# Altium project k7-325t.PrjPcb
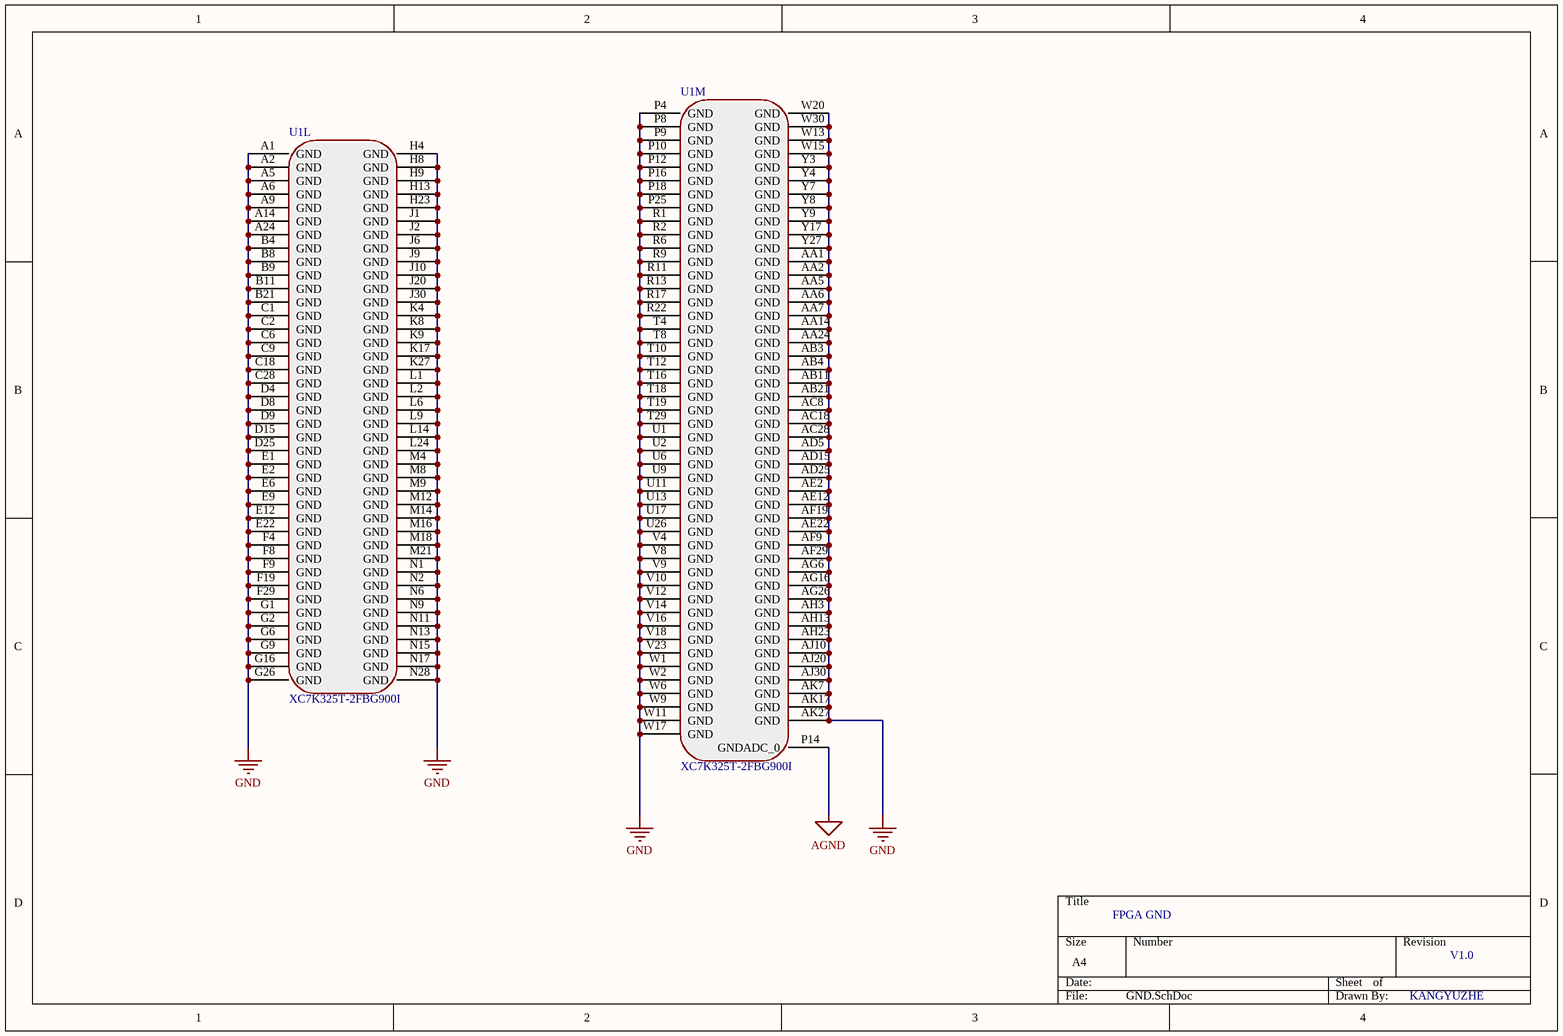
[diagram p0: GND.SchDoc]
15 sheets, 139 parts. Net scope: global (net labels, ports and power ports of the same name join across sheets).
Board files: PCB1.PcbDoc, XC7K325T.PcbDoc
Sheets:
  GND.SchDoc
  BANK0.SchDoc
  BANK12-13.SchDoc
  BANK14-15.SchDoc
  BANK16-17.SchDoc
  BANK18.SchDoc
  BANK32-33.SchDoc
  BANK34.SchDoc
  SD&UART&Sensor.SchDoc
  BANK115-116-117-118.SchDoc
  FPGA Power.SchDoc
  PAGE15 FLASH.SchDoc
  CLOCK.SchDoc
  INPUT.SchDoc
  IO.SchDoc

## Sheet GND.SchDoc
size A4

### Parts
U1  XC7K325T-2FBG900I  [FBG900]  (parts L,M of 17)

### Nets
AGND: U1.P14(GNDADC_0)
GND: U1.A1(GND) U1.A2(GND) U1.A5(GND) U1.A6(GND) U1.A9(GND) U1.A14(GND) U1.A24(GND) U1.AA1(GND) U1.AA2(GND) U1.AA5(GND) U1.AA6(GND) U1.AA7(GND) U1.AA14(GND) U1.AA24(GND) U1.AB3(GND) U1.AB4(GND) U1.AB11(GND) U1.AB21(GND) U1.AC8(GND) U1.AC18(GND) U1.AC28(GND) U1.AD5(GND) U1.AD15(GND) U1.AD25(GND) U1.AE2(GND) U1.AE12(GND) U1.AE22(GND) U1.AF9(GND) U1.AF19(GND) U1.AF29(GND) U1.AG6(GND) U1.AG16(GND) U1.AG26(GND) U1.AH3(GND) U1.AH13(GND) U1.AH23(GND) U1.AJ10(GND) U1.AJ20(GND) U1.AJ30(GND) U1.AK7(GND) U1.AK17(GND) U1.AK27(GND) U1.B4(GND) U1.B8(GND) U1.B9(GND) U1.B11(GND) U1.B21(GND) U1.C1(GND) U1.C2(GND) U1.C6(GND) U1.C9(GND) U1.C18(GND) U1.C28(GND) U1.D4(GND) U1.D8(GND) U1.D9(GND) U1.D15(GND) U1.D25(GND) U1.E1(GND) U1.E2(GND) U1.E6(GND) U1.E9(GND) U1.E12(GND) U1.E22(GND) U1.F4(GND) U1.F8(GND) U1.F9(GND) U1.F19(GND) U1.F29(GND) U1.G1(GND) U1.G2(GND) U1.G6(GND) U1.G9(GND) U1.G16(GND) U1.G26(GND) U1.H4(GND) U1.H8(GND) U1.H9(GND) U1.H13(GND) U1.H23(GND) U1.J1(GND) U1.J2(GND) U1.J6(GND) U1.J9(GND) U1.J10(GND) U1.J20(GND) U1.J30(GND) U1.K4(GND) U1.K8(GND) U1.K9(GND) U1.K17(GND) U1.K27(GND) U1.L1(GND) U1.L2(GND) U1.L6(GND) U1.L9(GND) U1.L14(GND) U1.L24(GND) U1.M4(GND) U1.M8(GND) U1.M9(GND) U1.M12(GND) U1.M14(GND) U1.M16(GND) U1.M18(GND) U1.M21(GND) U1.N1(GND) U1.N2(GND) U1.N6(GND) U1.N9(GND) U1.N11(GND) U1.N13(GND) U1.N15(GND) U1.N17(GND) U1.N28(GND) U1.P4(GND) U1.P8(GND) U1.P9(GND) U1.P10(GND) U1.P12(GND) U1.P16(GND) U1.P18(GND) U1.P25(GND) U1.R1(GND) U1.R2(GND) U1.R6(GND) U1.R9(GND) U1.R11(GND) U1.R13(GND) U1.R17(GND) U1.R22(GND) U1.T4(GND) U1.T8(GND) U1.T10(GND) U1.T12(GND) U1.T16(GND) U1.T18(GND) U1.T19(GND) U1.T29(GND) U1.U1(GND) U1.U2(GND) U1.U6(GND) U1.U9(GND) U1.U11(GND) U1.U13(GND) U1.U17(GND) U1.U26(GND) U1.V4(GND) U1.V8(GND) U1.V9(GND) U1.V10(GND) U1.V12(GND) U1.V14(GND) U1.V16(GND) U1.V18(GND) U1.V23(GND) U1.W1(GND) U1.W2(GND) U1.W6(GND) U1.W9(GND) U1.W11(GND) U1.W13(GND) U1.W15(GND) U1.W17(GND) U1.W20(GND) U1.W30(GND) U1.Y3(GND) U1.Y4(GND) U1.Y7(GND) U1.Y8(GND) U1.Y9(GND) U1.Y17(GND) U1.Y27(GND)

### Notes on the sheet
- FPGA GND
- V1.0
- KANGYUZHE

## Sheet BANK0.SchDoc
size A4
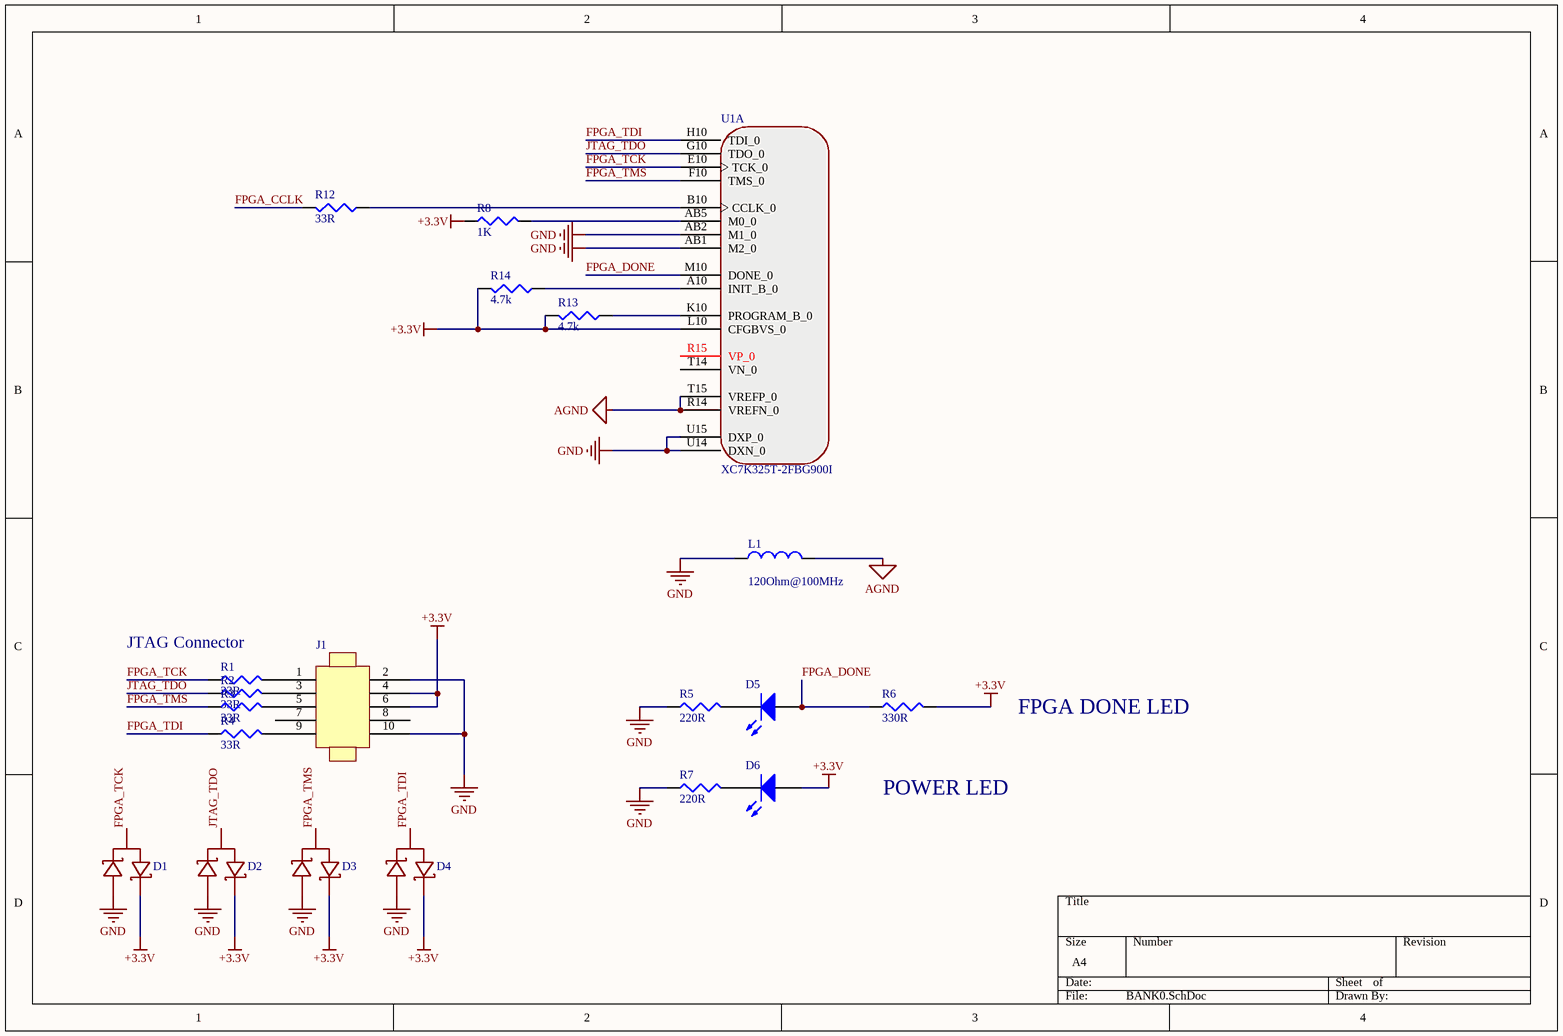
[diagram p1: BANK0.SchDoc]

### Parts
D1  BAT5S  [SOT-23]  (value not drawn)
D2  BAT5S  [SOT-23]  (value not drawn)
D3  BAT5S  [SOT-23]  (value not drawn)
D4  BAT5S  [SOT-23]  (value not drawn)
D5  LED3  [3.5X2.8X1.9]  (value not drawn)
D6  LED3  [3.5X2.8X1.9]  (value not drawn)
J1  JTAG-10  [JTAG-10]  (value not drawn)
L1  value 120Ohm@100MHz  [0402-A]  (hidden comment: Inductor)
R1  value 33R  [J1-0603]  (hidden comment: Res3)
R2  value 33R  [J1-0603]  (hidden comment: Res3)
R3  value 33R  [J1-0603]  (hidden comment: Res3)
R4  value 33R  [J1-0603]  (hidden comment: Res3)
R5  value 220R  [J1-0603]  (hidden comment: Res3)
R6  value 330R  [J1-0603]  (hidden comment: Res3)
R7  value 220R  [J1-0603]  (hidden comment: Res3)
R8  value 1K  [J1-0603]  (hidden comment: Res3)
R12  value 33R  [J1-0603]  (hidden comment: Res3)
R13  value 4.7k  [J1-0603]  (hidden comment: Res3)
R14  value 4.7k  [J1-0603]  (hidden comment: Res3)
U1  XC7K325T-2FBG900I  [FBG900]  (part A of 17)

### Nets
+3.3V: D1.2(K2) D2.2(K2) D3.2(K2) D4.2(K2) D6.1(A) J1.4 J1.6 R6.2 R8.1 R13.2 R14.2 U1.L10(CFGBVS_0)
AGND: L1.2 U1.R14(VREFN_0) U1.T15(VREFP_0)
GND: D1.1(A1) D2.1(A1) D3.1(A1) D4.1(A1) J1.2 J1.10 L1.1 R5.1 R7.1 U1.AB1(M2_0) U1.AB2(M1_0) U1.U14(DXN_0) U1.U15(DXP_0)
FPGA_CCLK: R12.2
FPGA_DONE: D5.1(A) R6.1 U1.M10(DONE_0)
FPGA_TCK: D1.3(A) R1.1 U1.E10(TCK_0)
FPGA_TDI: D4.3(A) R4.1 U1.H10(TDI_0)
FPGA_TMS: D3.3(A) R3.1 U1.F10(TMS_0)
JTAG_TDO: D2.3(A) R2.1 U1.G10(TDO_0)
NetD5_2: D5.2(K) R5.2
NetD6_2: D6.2(K) R7.2
NetJ1_1: J1.1 R1.2
NetJ1_3: J1.3 R2.2
NetJ1_5: J1.5 R3.2
NetJ1_9: J1.9 R4.2
NetR8_2: R8.2 U1.AB5(M0_0)
NetR12_1: R12.1 U1.B10(CCLK_0)
NetR13_1: R13.1 U1.K10(PROGRAM_B_0)
NetR14_1: R14.1 U1.A10(INIT_B_0)

Not connected (* = marked no-connect by the designer): J1 7 8; U1 R15(VP_0) T14(VN_0)

### Notes on the sheet
- JTAG Connector
- FPGA DONE LED
- POWER LED

### Library data of the parts
D5 D6 = LED3: Typical BLUE SiC LED; Published: 8-Jun-2000; LatestRevisionDate: 17-Dec-2003; LatestRevisionNote: PCB Footprint replaced.; DatasheetVersion: 16-Apr-2002; PackageVersion: 16-Apr-2002; PackageReference: 3.5X2.8X1.9; Publisher: Altium Limited; PackageDescription: SM LED; 2 C-Bend Leads; Body 3.5 x 2.8 x 1.9 mm, inc leads (LxWxH typ)
L1 = Inductor: Code_IEC: 1005; Published: 8-Jun-2000; LatestRevisionDate: 29-May-2009; LatestRevisionNote: IPC-7351 Footprint Added.; PackageReference: 0402-A; Publisher: Altium Limited; PackageDescription: Chip Inductor; Code_JEITA: 0402
R1-R8 R12-R14 = Res3: Resistor; Published: 8-Jun-2000; LatestRevisionDate: 29-May-2009; LatestRevisionNote: IPC-7351 Footprint Added.; PackageReference: J1-0603; Publisher: Altium Limited; PackageDescription: Chip Resistor

## Sheet BANK12-13.SchDoc
size A4
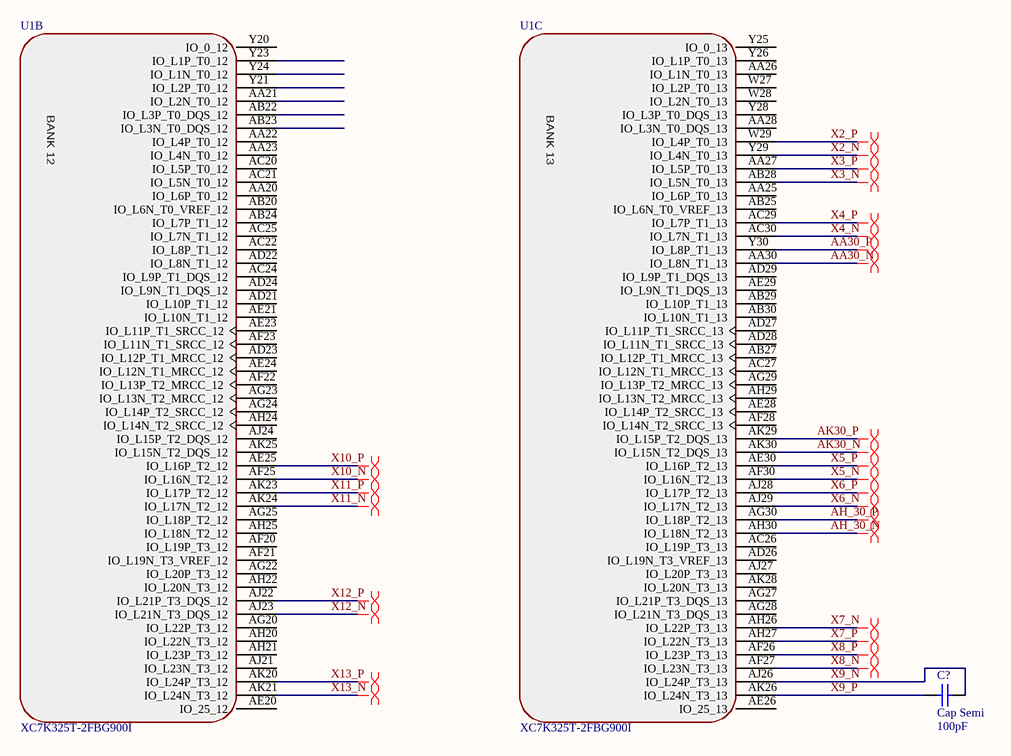
[diagram p2: BANK12-13.SchDoc]

### Parts
C?  Cap Semi  value 100pF  [C1206]
U1  XC7K325T-2FBG900I  [FBG900]  (parts B,C of 17)

### Nets
AA30_N: U1.AA30(IO_L8N_T1_13)
AA30_P: U1.Y30(IO_L8P_T1_13)
AH_30_N: U1.AH30(IO_L18N_T2_13)
AH_30_P: U1.AG30(IO_L18P_T2_13)
AK30_N: U1.AK30(IO_L15N_T2_DQS_13)
AK30_P: U1.AK29(IO_L15P_T2_DQS_13)
X2_N: U1.Y29(IO_L4N_T0_13)
X2_P: U1.W29(IO_L4P_T0_13)
X3_N: U1.AB28(IO_L5N_T0_13)
X3_P: U1.AA27(IO_L5P_T0_13)
X4_N: U1.AC30(IO_L7N_T1_13)
X4_P: U1.AC29(IO_L7P_T1_13)
X5_N: U1.AF30(IO_L16N_T2_13)
X5_P: U1.AE30(IO_L16P_T2_13)
X6_N: U1.AJ29(IO_L17N_T2_13)
X6_P: U1.AJ28(IO_L17P_T2_13)
X7_N: U1.AH26(IO_L22P_T3_13)
X7_P: U1.AH27(IO_L22N_T3_13)
X8_N: U1.AF27(IO_L23N_T3_13)
X8_P: U1.AF26(IO_L23P_T3_13)
X9_N: C?.2 U1.AJ26(IO_L24P_T3_13)
X9_P: C?.1 U1.AK26(IO_L24N_T3_13)
X10_N: U1.AF25(IO_L16N_T2_12)
X10_P: U1.AE25(IO_L16P_T2_12)
X11_N: U1.AK24(IO_L17N_T2_12)
X11_P: U1.AK23(IO_L17P_T2_12)
X12_N: U1.AJ23(IO_L21N_T3_DQS_12)
X12_P: U1.AJ22(IO_L21P_T3_DQS_12)
X13_N: U1.AK21(IO_L24N_T3_12)
X13_P: U1.AK20(IO_L24P_T3_12)

Not connected (* = marked no-connect by the designer): U1 AA20(IO_L6P_T0_12) AA21(IO_L2N_T0_12) AA22(IO_L4P_T0_12) AA23(IO_L4N_T0_12) AA25(IO_L6P_T0_13) AA26(IO_L1N_T0_13) AA28(IO_L3N_T0_DQS_13) AB20(IO_L6N_T0_VREF_12) AB22(IO_L3P_T0_DQS_12) AB23(IO_L3N_T0_DQS_12) AB24(IO_L7P_T1_12) AB25(IO_L6N_T0_VREF_13) AB27(IO_L12P_T1_MRCC_13) AB29(IO_L10P_T1_13) AB30(IO_L10N_T1_13) AC20(IO_L5P_T0_12) AC21(IO_L5N_T0_12) AC22(IO_L8P_T1_12) AC24(IO_L9P_T1_DQS_12) AC25(IO_L7N_T1_12) AC26(IO_L19P_T3_13) AC27(IO_L12N_T1_MRCC_13) AD21(IO_L10P_T1_12) AD22(IO_L8N_T1_12) AD23(IO_L12P_T1_MRCC_12) AD24(IO_L9N_T1_DQS_12) AD26(IO_L19N_T3_VREF_13) AD27(IO_L11P_T1_SRCC_13) AD28(IO_L11N_T1_SRCC_13) AD29(IO_L9P_T1_DQS_13) AE20(IO_25_12) AE21(IO_L10N_T1_12) AE23(IO_L11P_T1_SRCC_12) AE24(IO_L12N_T1_MRCC_12) AE26(IO_25_13) AE28(IO_L14P_T2_SRCC_13) AE29(IO_L9N_T1_DQS_13) AF20(IO_L19P_T3_12) AF21(IO_L19N_T3_VREF_12) AF22(IO_L13P_T2_MRCC_12) AF23(IO_L11N_T1_SRCC_12) AF28(IO_L14N_T2_SRCC_13) AG20(IO_L22P_T3_12) AG22(IO_L20P_T3_12) AG23(IO_L13N_T2_MRCC_12) AG24(IO_L14P_T2_SRCC_12) AG25(IO_L18P_T2_12) AG27(IO_L21P_T3_DQS_13) AG28(IO_L21N_T3_DQS_13) AG29(IO_L13P_T2_MRCC_13) AH20(IO_L22N_T3_12) AH21(IO_L23P_T3_12) AH22(IO_L20N_T3_12) AH24(IO_L14N_T2_SRCC_12) AH25(IO_L18N_T2_12) AH29(IO_L13N_T2_MRCC_13) AJ21(IO_L23N_T3_12) AJ24(IO_L15P_T2_DQS_12) AJ27(IO_L20P_T3_13) AK25(IO_L15N_T2_DQS_12) AK28(IO_L20N_T3_13) W27(IO_L2P_T0_13) W28(IO_L2N_T0_13) Y20(IO_0_12) Y21(IO_L2P_T0_12) Y23(IO_L1P_T0_12) Y24(IO_L1N_T0_12) Y25(IO_0_13) Y26(IO_L1P_T0_13) Y28(IO_L3P_T0_DQS_13)

### Layout directives
differential pair: AA30_N, AA30_P, AH_30_N, AH_30_P, AK30_N, AK30_P, X2_N, X2_P, X3_N, X3_P, X4_N, X4_P, X5_N, X5_P, X6_N, X6_P, X7_N, X7_P, X8_N, X8_P, X10_N, X10_P, X11_N, X11_P, X12_N, X12_P, X13_N, X13_P

### Notes on the sheet
- (in symbol XC7K325T-2FBG900I, part B) BANK 12
- (in symbol XC7K325T-2FBG900I, part C) BANK 13

### Library data of the parts
C? = Cap Semi: Capacitor (Semiconductor SIM Model); Published: 8-Jun-2000; LatestRevisionDate: 29-May-2009; LatestRevisionNote: IPC-7351 Footprint Added.; PackageReference: C1206; Publisher: Altium Limited; PackageDescription: Chip Capacitor

## Sheet BANK14-15.SchDoc
size A4
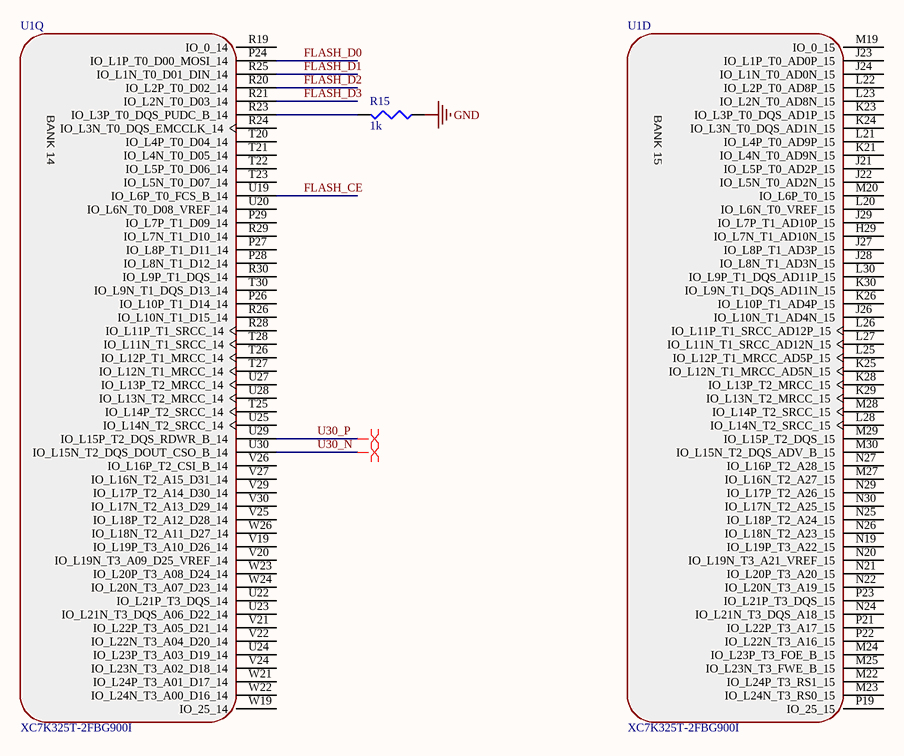
[diagram p3: BANK14-15.SchDoc]

### Parts
R15  value 1k  [J1-0603]  (hidden comment: Res3)
U1  XC7K325T-2FBG900I  [FBG900]  (parts D,Q of 17)

### Nets
GND: R15.1
FLASH_CE: U1.U19(IO_L6P_T0_FCS_B_14)
FLASH_D0: U1.P24(IO_L1P_T0_D00_MOSI_14)
FLASH_D1: U1.R25(IO_L1N_T0_D01_DIN_14)
FLASH_D2: U1.R20(IO_L2P_T0_D02_14)
FLASH_D3: U1.R21(IO_L2N_T0_D03_14)
U30_N: U1.U30(IO_L15N_T2_DQS_DOUT_CSO_B_14)
U30_P: U1.U29(IO_L15P_T2_DQS_RDWR_B_14)
NetR15_2: R15.2 U1.R23(IO_L3P_T0_DQS_PUDC_B_14)

Not connected (* = marked no-connect by the designer): U1 H29(IO_L7N_T1_AD10N_15) J21(IO_L5P_T0_AD2P_15) J22(IO_L5N_T0_AD2N_15) J23(IO_L1P_T0_AD0P_15) J24(IO_L1N_T0_AD0N_15) J26(IO_L10N_T1_AD4N_15) J27(IO_L8P_T1_AD3P_15) J28(IO_L8N_T1_AD3N_15) J29(IO_L7P_T1_AD10P_15) K21(IO_L4N_T0_AD9N_15) K23(IO_L3P_T0_DQS_AD1P_15) K24(IO_L3N_T0_DQS_AD1N_15) K25(IO_L12N_T1_MRCC_AD5N_15) K26(IO_L10P_T1_AD4P_15) K28(IO_L13P_T2_MRCC_15) K29(IO_L13N_T2_MRCC_15) K30(IO_L9N_T1_DQS_AD11N_15) L20(IO_L6N_T0_VREF_15) L21(IO_L4P_T0_AD9P_15) L22(IO_L2P_T0_AD8P_15) L23(IO_L2N_T0_AD8N_15) L25(IO_L12P_T1_MRCC_AD5P_15) L26(IO_L11P_T1_SRCC_AD12P_15) L27(IO_L11N_T1_SRCC_AD12N_15) L28(IO_L14N_T2_SRCC_15) L30(IO_L9P_T1_DQS_AD11P_15) M19(IO_0_15) M20(IO_L6P_T0_15) M22(IO_L24P_T3_RS1_15) M23(IO_L24N_T3_RS0_15) M24(IO_L23P_T3_FOE_B_15) M25(IO_L23N_T3_FWE_B_15) M27(IO_L16N_T2_A27_15) M28(IO_L14P_T2_SRCC_15) M29(IO_L15P_T2_DQS_15) M30(IO_L15N_T2_DQS_ADV_B_15) N19(IO_L19P_T3_A22_15) N20(IO_L19N_T3_A21_VREF_15) N21(IO_L20P_T3_A20_15) N22(IO_L20N_T3_A19_15) N24(IO_L21N_T3_DQS_A18_15) N25(IO_L18P_T2_A24_15) N26(IO_L18N_T2_A23_15) N27(IO_L16P_T2_A28_15) N29(IO_L17P_T2_A26_15) N30(IO_L17N_T2_A25_15) P19(IO_25_15) P21(IO_L22P_T3_A17_15) P22(IO_L22N_T3_A16_15) P23(IO_L21P_T3_DQS_15) P26(IO_L10P_T1_D14_14) P27(IO_L8P_T1_D11_14) P28(IO_L8N_T1_D12_14) P29(IO_L7P_T1_D09_14) R19(IO_0_14) R24(IO_L3N_T0_DQS_EMCCLK_14) R26(IO_L10N_T1_D15_14) R28(IO_L11P_T1_SRCC_14) R29(IO_L7N_T1_D10_14) R30(IO_L9P_T1_DQS_14) T20(IO_L4P_T0_D04_14) T21(IO_L4N_T0_D05_14) T22(IO_L5P_T0_D06_14) T23(IO_L5N_T0_D07_14) T25(IO_L14P_T2_SRCC_14) T26(IO_L12P_T1_MRCC_14) T27(IO_L12N_T1_MRCC_14) T28(IO_L11N_T1_SRCC_14) T30(IO_L9N_T1_DQS_D13_14) U20(IO_L6N_T0_D08_VREF_14) U22(IO_L21P_T3_DQS_14) U23(IO_L21N_T3_DQS_A06_D22_14) U24(IO_L23P_T3_A03_D19_14) U25(IO_L14N_T2_SRCC_14) U27(IO_L13P_T2_MRCC_14) U28(IO_L13N_T2_MRCC_14) V19(IO_L19P_T3_A10_D26_14) V20(IO_L19N_T3_A09_D25_VREF_14) V21(IO_L22P_T3_A05_D21_14) V22(IO_L22N_T3_A04_D20_14) V24(IO_L23N_T3_A02_D18_14) V25(IO_L18P_T2_A12_D28_14) V26(IO_L16P_T2_CSI_B_14) V27(IO_L16N_T2_A15_D31_14) V29(IO_L17P_T2_A14_D30_14) V30(IO_L17N_T2_A13_D29_14) W19(IO_25_14) W21(IO_L24P_T3_A01_D17_14) W22(IO_L24N_T3_A00_D16_14) W23(IO_L20P_T3_A08_D24_14) W24(IO_L20N_T3_A07_D23_14) W26(IO_L18N_T2_A11_D27_14)

### Layout directives
differential pair: U30_N, U30_P

### Notes on the sheet
- (in symbol XC7K325T-2FBG900I, part D) BANK 15
- (in symbol XC7K325T-2FBG900I, part Q) BANK 14

### Library data of the parts
R15 = Res3: Resistor; Published: 8-Jun-2000; LatestRevisionDate: 29-May-2009; LatestRevisionNote: IPC-7351 Footprint Added.; PackageReference: J1-0603; Publisher: Altium Limited; PackageDescription: Chip Resistor

## Sheet BANK16-17.SchDoc
size A4
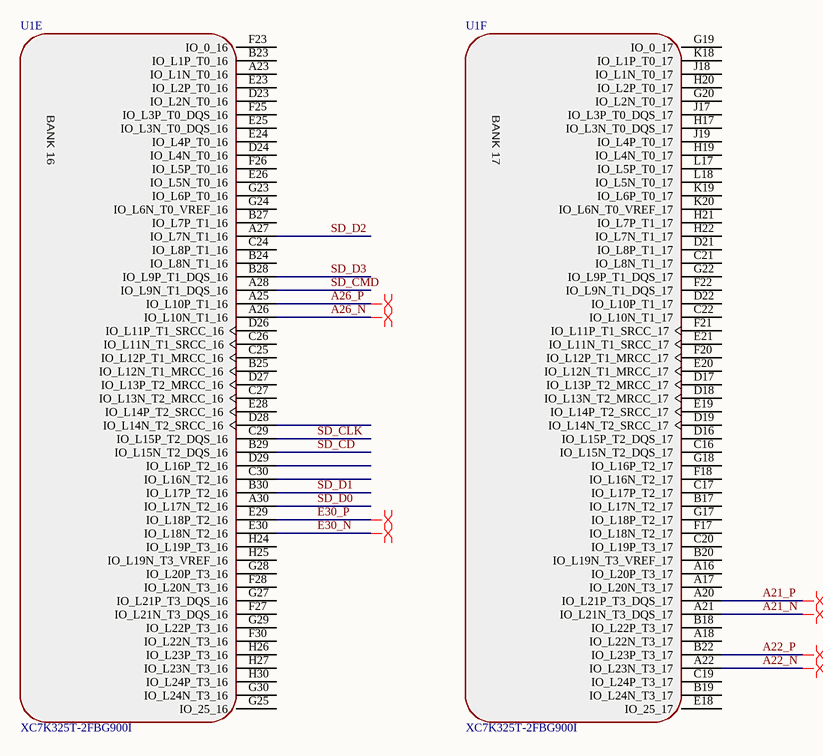
[diagram p4: BANK16-17.SchDoc]

### Parts
U1  XC7K325T-2FBG900I  [FBG900]  (parts E,F of 17)

### Nets
A21_N: U1.A21(IO_L21N_T3_DQS_17)
A21_P: U1.A20(IO_L21P_T3_DQS_17)
A22_N: U1.A22(IO_L23N_T3_17)
A22_P: U1.B22(IO_L23P_T3_17)
A26_N: U1.A26(IO_L10N_T1_16)
A26_P: U1.A25(IO_L10P_T1_16)
E30_N: U1.E30(IO_L18N_T2_16)
E30_P: U1.E29(IO_L18P_T2_16)
SD_CD: U1.B29(IO_L15N_T2_DQS_16)
SD_CLK: U1.C29(IO_L15P_T2_DQS_16)
SD_CMD: U1.A28(IO_L9N_T1_DQS_16)
SD_D0: U1.A30(IO_L17N_T2_16)
SD_D1: U1.B30(IO_L17P_T2_16)
SD_D2: U1.A27(IO_L7N_T1_16)
SD_D3: U1.B28(IO_L9P_T1_DQS_16)

Not connected (* = marked no-connect by the designer): U1 A16(IO_L20P_T3_17) A17(IO_L20N_T3_17) A18(IO_L22N_T3_17) A23(IO_L1N_T0_16) B17(IO_L17N_T2_17) B18(IO_L22P_T3_17) B19(IO_L24N_T3_17) B20(IO_L19N_T3_VREF_17) B23(IO_L1P_T0_16) B24(IO_L8N_T1_16) B25(IO_L12N_T1_MRCC_16) B27(IO_L7P_T1_16) C16(IO_L15N_T2_DQS_17) C17(IO_L17P_T2_17) C19(IO_L24P_T3_17) C20(IO_L19P_T3_17) C21(IO_L8N_T1_17) C22(IO_L10N_T1_17) C24(IO_L8P_T1_16) C25(IO_L12P_T1_MRCC_16) C26(IO_L11N_T1_SRCC_16) C27(IO_L13N_T2_MRCC_16) C30(IO_L16N_T2_16) D16(IO_L15P_T2_DQS_17) D17(IO_L13P_T2_MRCC_17) D18(IO_L13N_T2_MRCC_17) D19(IO_L14N_T2_SRCC_17) D21(IO_L8P_T1_17) D22(IO_L10P_T1_17) D23(IO_L2N_T0_16) D24(IO_L4N_T0_16) D26(IO_L11P_T1_SRCC_16) D27(IO_L13P_T2_MRCC_16) D28(IO_L14N_T2_SRCC_16) D29(IO_L16P_T2_16) E18(IO_25_17) E19(IO_L14P_T2_SRCC_17) E20(IO_L12N_T1_MRCC_17) E21(IO_L11N_T1_SRCC_17) E23(IO_L2P_T0_16) E24(IO_L4P_T0_16) E25(IO_L3N_T0_DQS_16) E26(IO_L5N_T0_16) E28(IO_L14P_T2_SRCC_16) F17(IO_L18N_T2_17) F18(IO_L16N_T2_17) F20(IO_L12P_T1_MRCC_17) F21(IO_L11P_T1_SRCC_17) F22(IO_L9N_T1_DQS_17) F23(IO_0_16) F25(IO_L3P_T0_DQS_16) F26(IO_L5P_T0_16) F27(IO_L21N_T3_DQS_16) F28(IO_L20N_T3_16) F30(IO_L22N_T3_16) G17(IO_L18P_T2_17) G18(IO_L16P_T2_17) G19(IO_0_17) G20(IO_L2N_T0_17) G22(IO_L9P_T1_DQS_17) G23(IO_L6P_T0_16) G24(IO_L6N_T0_VREF_16) G25(IO_25_16) G27(IO_L21P_T3_DQS_16) G28(IO_L20P_T3_16) G29(IO_L22P_T3_16) G30(IO_L24N_T3_16) H17(IO_L3N_T0_DQS_17) H19(IO_L4N_T0_17) H20(IO_L2P_T0_17) H21(IO_L7P_T1_17) H22(IO_L7N_T1_17) H24(IO_L19P_T3_16) H25(IO_L19N_T3_VREF_16) H26(IO_L23P_T3_16) H27(IO_L23N_T3_16) H30(IO_L24P_T3_16) J17(IO_L3P_T0_DQS_17) J18(IO_L1N_T0_17) J19(IO_L4P_T0_17) K18(IO_L1P_T0_17) K19(IO_L6P_T0_17) K20(IO_L6N_T0_VREF_17) L17(IO_L5P_T0_17) L18(IO_L5N_T0_17)

### Layout directives
differential pair: A21_N, A21_P, A22_N, A22_P, A26_N, A26_P, E30_N, E30_P

### Notes on the sheet
- (in symbol XC7K325T-2FBG900I, part E) BANK 16
- (in symbol XC7K325T-2FBG900I, part F) BANK 17

## Sheet BANK18.SchDoc
size A4
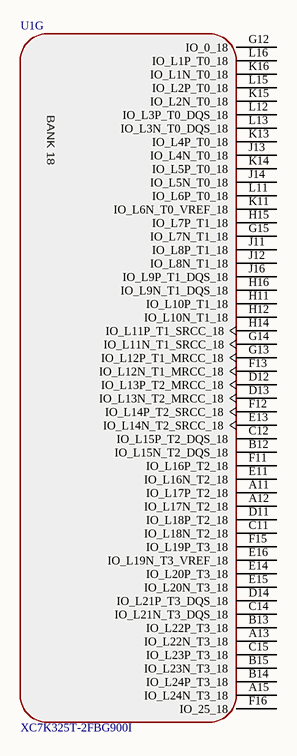
[diagram p5: BANK18.SchDoc]

### Parts
U1  XC7K325T-2FBG900I  [FBG900]  (part G of 17)

### Nets

Not connected (* = marked no-connect by the designer): U1 A11(IO_L17P_T2_18) A12(IO_L17N_T2_18) A13(IO_L22N_T3_18) A15(IO_L24N_T3_18) B12(IO_L15N_T2_DQS_18) B13(IO_L22P_T3_18) B14(IO_L24P_T3_18) B15(IO_L23N_T3_18) C11(IO_L18N_T2_18) C12(IO_L15P_T2_DQS_18) C14(IO_L21N_T3_DQS_18) C15(IO_L23P_T3_18) D11(IO_L18P_T2_18) D12(IO_L13P_T2_MRCC_18) D13(IO_L13N_T2_MRCC_18) D14(IO_L21P_T3_DQS_18) E11(IO_L16N_T2_18) E13(IO_L14N_T2_SRCC_18) E14(IO_L20P_T3_18) E15(IO_L20N_T3_18) E16(IO_L19N_T3_VREF_18) F11(IO_L16P_T2_18) F12(IO_L14P_T2_SRCC_18) F13(IO_L12N_T1_MRCC_18) F15(IO_L19P_T3_18) F16(IO_25_18) G12(IO_0_18) G13(IO_L12P_T1_MRCC_18) G14(IO_L11N_T1_SRCC_18) G15(IO_L7N_T1_18) H11(IO_L10P_T1_18) H12(IO_L10N_T1_18) H14(IO_L11P_T1_SRCC_18) H15(IO_L7P_T1_18) H16(IO_L9N_T1_DQS_18) J11(IO_L8P_T1_18) J12(IO_L8N_T1_18) J13(IO_L4N_T0_18) J14(IO_L5N_T0_18) J16(IO_L9P_T1_DQS_18) K11(IO_L6N_T0_VREF_18) K13(IO_L4P_T0_18) K14(IO_L5P_T0_18) K15(IO_L2N_T0_18) K16(IO_L1N_T0_18) L11(IO_L6P_T0_18) L12(IO_L3P_T0_DQS_18) L13(IO_L3N_T0_DQS_18) L15(IO_L2P_T0_18) L16(IO_L1P_T0_18)

### Notes on the sheet
- (in symbol XC7K325T-2FBG900I, part G) BANK 18

## Sheet BANK32-33.SchDoc
size A4
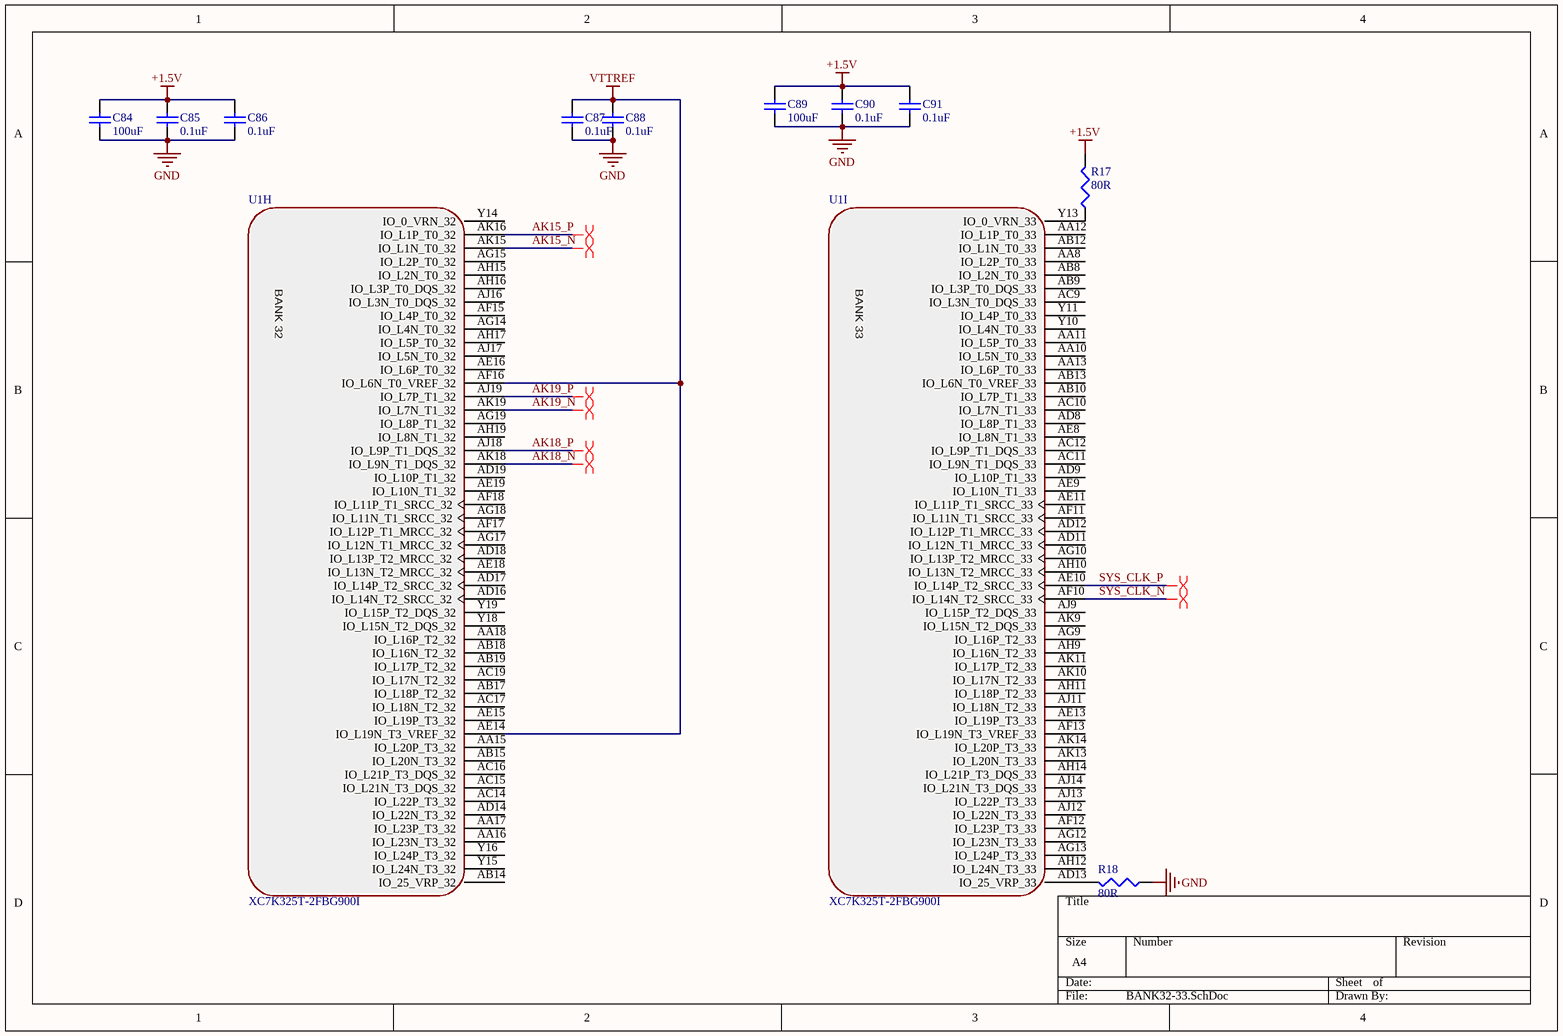
[diagram p6: BANK32-33.SchDoc]

### Parts
C84  value 100uF  [0402]  (hidden comment: Cap Semi)
C85  value 0.1uF  [0402]  (hidden comment: Cap Semi)
C86  value 0.1uF  [0402]  (hidden comment: Cap Semi)
C87  value 0.1uF  [0402]  (hidden comment: Cap Semi)
C88  value 0.1uF  [0402]  (hidden comment: Cap Semi)
C89  value 100uF  [0402]  (hidden comment: Cap Semi)
C90  value 0.1uF  [0402]  (hidden comment: Cap Semi)
C91  value 0.1uF  [0402]  (hidden comment: Cap Semi)
R17  value 80R  [J1-0603]  (hidden comment: Res3)
R18  value 80R  [J1-0603]  (hidden comment: Res3)
U1  XC7K325T-2FBG900I  (parts H,I of 17)

### Nets
+1.5V: C84.2 C85.2 C86.2 C89.2 C90.2 C91.2 R17.2
GND: C84.1 C85.1 C86.1 C87.1 C88.1 C89.1 C90.1 C91.1 R18.1
VTTREF: C87.2 C88.2 U1.AE14(IO_L19N_T3_VREF_32) U1.AF16(IO_L6N_T0_VREF_32)
AK15_N: U1.AK15(IO_L1N_T0_32)
AK15_P: U1.AK16(IO_L1P_T0_32)
AK18_N: U1.AK18(IO_L9N_T1_DQS_32)
AK18_P: U1.AJ18(IO_L9P_T1_DQS_32)
AK19_N: U1.AK19(IO_L7N_T1_32)
AK19_P: U1.AJ19(IO_L7P_T1_32)
SYS_CLK_N: U1.AF10(IO_L14N_T2_SRCC_33)
SYS_CLK_P: U1.AE10(IO_L14P_T2_SRCC_33)
NetR17_1: R17.1 U1.Y13(IO_0_VRN_33)
NetR18_2: R18.2 U1.AD13(IO_25_VRP_33)

Not connected (* = marked no-connect by the designer): U1 AA8(IO_L2P_T0_33) AA10(IO_L5N_T0_33) AA11(IO_L5P_T0_33) AA12(IO_L1P_T0_33) AA13(IO_L6P_T0_33) AA15(IO_L20P_T3_32) AA16(IO_L23N_T3_32) AA17(IO_L23P_T3_32) AA18(IO_L16P_T2_32) AB8(IO_L2N_T0_33) AB9(IO_L3P_T0_DQS_33) AB10(IO_L7P_T1_33) AB12(IO_L1N_T0_33) AB13(IO_L6N_T0_VREF_33) AB14(IO_25_VRP_32) AB15(IO_L20N_T3_32) AB17(IO_L18P_T2_32) AB18(IO_L16N_T2_32) AB19(IO_L17P_T2_32) AC9(IO_L3N_T0_DQS_33) AC10(IO_L7N_T1_33) AC11(IO_L9N_T1_DQS_33) AC12(IO_L9P_T1_DQS_33) AC14(IO_L22P_T3_32) AC15(IO_L21N_T3_DQS_32) AC16(IO_L21P_T3_DQS_32) AC17(IO_L18N_T2_32) AC19(IO_L17N_T2_32) AD8(IO_L8P_T1_33) AD9(IO_L10P_T1_33) AD11(IO_L12N_T1_MRCC_33) AD12(IO_L12P_T1_MRCC_33) AD14(IO_L22N_T3_32) AD16(IO_L14N_T2_SRCC_32) AD17(IO_L14P_T2_SRCC_32) AD18(IO_L13P_T2_MRCC_32) AD19(IO_L10P_T1_32) AE8(IO_L8N_T1_33) AE9(IO_L10N_T1_33) AE11(IO_L11P_T1_SRCC_33) AE13(IO_L19P_T3_33) AE15(IO_L19P_T3_32) AE16(IO_L6P_T0_32) AE18(IO_L13N_T2_MRCC_32) AE19(IO_L10N_T1_32) AF11(IO_L11N_T1_SRCC_33) AF12(IO_L23P_T3_33) AF13(IO_L19N_T3_VREF_33) AF15(IO_L4P_T0_32) AF17(IO_L12P_T1_MRCC_32) AF18(IO_L11P_T1_SRCC_32) AG9(IO_L16P_T2_33) AG10(IO_L13P_T2_MRCC_33) AG12(IO_L23N_T3_33) AG13(IO_L24P_T3_33) AG14(IO_L4N_T0_32) AG15(IO_L2P_T0_32) AG17(IO_L12N_T1_MRCC_32) AG18(IO_L11N_T1_SRCC_32) AG19(IO_L8P_T1_32) AH9(IO_L16N_T2_33) AH10(IO_L13N_T2_MRCC_33) AH11(IO_L18P_T2_33) AH12(IO_L24N_T3_33) AH14(IO_L21P_T3_DQS_33) AH15(IO_L2N_T0_32) AH16(IO_L3P_T0_DQS_32) AH17(IO_L5P_T0_32) AH19(IO_L8N_T1_32) AJ9(IO_L15P_T2_DQS_33) AJ11(IO_L18N_T2_33) AJ12(IO_L22N_T3_33) AJ13(IO_L22P_T3_33) AJ14(IO_L21N_T3_DQS_33) AJ16(IO_L3N_T0_DQS_32) AJ17(IO_L5N_T0_32) AK9(IO_L15N_T2_DQS_33) AK10(IO_L17N_T2_33) AK11(IO_L17P_T2_33) AK13(IO_L20N_T3_33) AK14(IO_L20P_T3_33) Y10(IO_L4N_T0_33) Y11(IO_L4P_T0_33) Y14(IO_0_VRN_32) Y15(IO_L24N_T3_32) Y16(IO_L24P_T3_32) Y18(IO_L15N_T2_DQS_32) Y19(IO_L15P_T2_DQS_32)

### Layout directives
differential pair: AK15_N, AK15_P, AK18_N, AK18_P, AK19_N, AK19_P, SYS_CLK_N, SYS_CLK_P

### Notes on the sheet
- (in symbol XC7K325T-2FBG900I, part H) BANK 32
- (in symbol XC7K325T-2FBG900I, part I) BANK 33

### Library data of the parts
C84-C91 = Cap Semi: Capacitor (Semiconductor SIM Model); Published: 8-Jun-2000; LatestRevisionDate: 29-May-2009; LatestRevisionNote: IPC-7351 Footprint Added.; PackageReference: C1206; Publisher: Altium Limited; PackageDescription: Chip Capacitor
R17 R18 = Res3: Resistor; Published: 8-Jun-2000; LatestRevisionDate: 29-May-2009; LatestRevisionNote: IPC-7351 Footprint Added.; PackageReference: J1-0603; Publisher: Altium Limited; PackageDescription: Chip Resistor

## Sheet BANK34.SchDoc
size A4
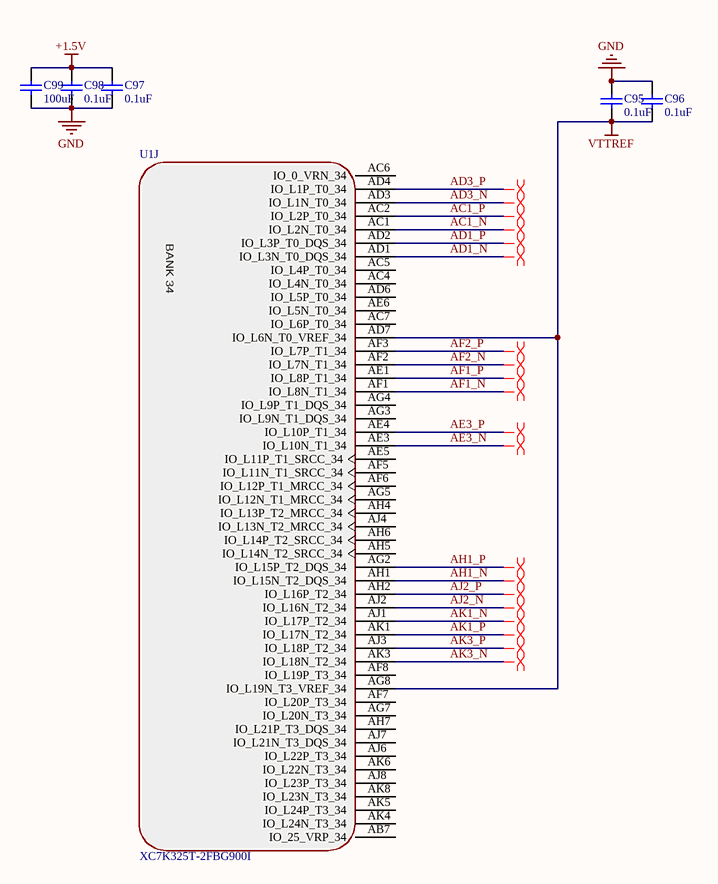
[diagram p7: BANK34.SchDoc]

### Parts
C95  value 0.1uF  [0402]  (hidden comment: Cap Semi)
C96  value 0.1uF  [0402]  (hidden comment: Cap Semi)
C97  value 0.1uF  [0402]  (hidden comment: Cap Semi)
C98  value 0.1uF  [0402]  (hidden comment: Cap Semi)
C99  value 100uF  [0402]  (hidden comment: Cap Semi)
U1  XC7K325T-2FBG900I  (part J of 17)

### Nets
+1.5V: C97.2 C98.2 C99.2
GND: C95.2 C96.2 C97.1 C98.1 C99.1
VTTREF: C95.1 C96.1 U1.AD7(IO_L6N_T0_VREF_34) U1.AG8(IO_L19N_T3_VREF_34)
AC1_N: U1.AC1(IO_L2N_T0_34)
AC1_P: U1.AC2(IO_L2P_T0_34)
AD1_N: U1.AD1(IO_L3N_T0_DQS_34)
AD1_P: U1.AD2(IO_L3P_T0_DQS_34)
AD3_N: U1.AD3(IO_L1N_T0_34)
AD3_P: U1.AD4(IO_L1P_T0_34)
AE3_N: U1.AE3(IO_L10N_T1_34)
AE3_P: U1.AE4(IO_L10P_T1_34)
AF1_N: U1.AF1(IO_L8N_T1_34)
AF1_P: U1.AE1(IO_L8P_T1_34)
AF2_N: U1.AF2(IO_L7N_T1_34)
AF2_P: U1.AF3(IO_L7P_T1_34)
AH1_N: U1.AH1(IO_L15N_T2_DQS_34)
AH1_P: U1.AG2(IO_L15P_T2_DQS_34)
AJ2_N: U1.AJ2(IO_L16N_T2_34)
AJ2_P: U1.AH2(IO_L16P_T2_34)
AK1_N: U1.AJ1(IO_L17P_T2_34)
AK1_P: U1.AK1(IO_L17N_T2_34)
AK3_N: U1.AK3(IO_L18N_T2_34)
AK3_P: U1.AJ3(IO_L18P_T2_34)

Not connected (* = marked no-connect by the designer): U1 AB7(IO_25_VRP_34) AC4(IO_L4N_T0_34) AC5(IO_L4P_T0_34) AC6(IO_0_VRN_34) AC7(IO_L6P_T0_34) AD6(IO_L5P_T0_34) AE5(IO_L11P_T1_SRCC_34) AE6(IO_L5N_T0_34) AF5(IO_L11N_T1_SRCC_34) AF6(IO_L12P_T1_MRCC_34) AF7(IO_L20P_T3_34) AF8(IO_L19P_T3_34) AG3(IO_L9N_T1_DQS_34) AG4(IO_L9P_T1_DQS_34) AG5(IO_L12N_T1_MRCC_34) AG7(IO_L20N_T3_34) AH4(IO_L13P_T2_MRCC_34) AH5(IO_L14N_T2_SRCC_34) AH6(IO_L14P_T2_SRCC_34) AH7(IO_L21P_T3_DQS_34) AJ4(IO_L13N_T2_MRCC_34) AJ6(IO_L22P_T3_34) AJ7(IO_L21N_T3_DQS_34) AJ8(IO_L23P_T3_34) AK4(IO_L24N_T3_34) AK5(IO_L24P_T3_34) AK6(IO_L22N_T3_34) AK8(IO_L23N_T3_34)

### Layout directives
differential pair: AC1_N, AC1_P, AD1_N, AD1_P, AD3_N, AD3_P, AE3_N, AE3_P, AF1_N, AF1_P, AF2_N, AF2_P, AH1_N, AH1_P, AJ2_N, AJ2_P, AK1_N, AK1_P, AK3_N, AK3_P

### Notes on the sheet
- (in symbol XC7K325T-2FBG900I, part J) BANK 34

### Library data of the parts
C95-C99 = Cap Semi: Capacitor (Semiconductor SIM Model); Published: 8-Jun-2000; LatestRevisionDate: 29-May-2009; LatestRevisionNote: IPC-7351 Footprint Added.; PackageReference: C1206; Publisher: Altium Limited; PackageDescription: Chip Capacitor

## Sheet SD&UART&Sensor.SchDoc
size A4
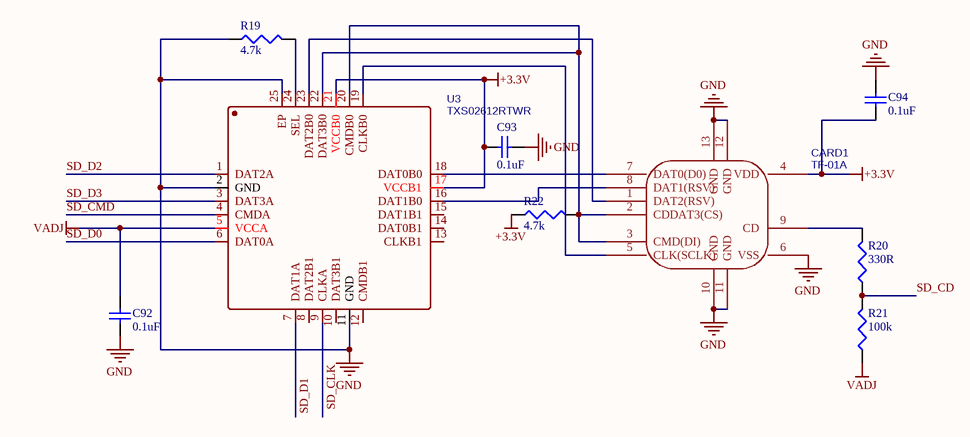
[diagram p8: SD&UART&Sensor.SchDoc]

### Parts
C92  value 0.1uF  [0402]  (hidden comment: Cap Semi)
C93  value 0.1uF  [0402]  (hidden comment: Cap Semi)
C94  value 0.1uF  [0402]  (hidden comment: Cap Semi)
CARD1  TF-01A  [MICRO_SD]
R19  value 4.7k  [J1-0603]  (hidden comment: Res3)
R20  value 330R  [J1-0603]  (hidden comment: Res3)
R21  value 100k  [J1-0603]  (hidden comment: Res3)
R22  value 4.7k  [J1-0603]  (hidden comment: Res3)
U3  TXS02612RTWR  [QFN24_RTW]

### Nets
+3.3V: C93.2 C94.1 CARD1.4(VDD) R22.1 U3.17(VCCB1) U3.21(VCCB0)
GND: C92.1 C93.1 C94.2 CARD1.6(VSS) CARD1.10(GND) CARD1.11(GND) CARD1.12(GND) CARD1.13(GND) R19.1 U3.2(GND) U3.11(GND) U3.25(EP)
VADJ: C92.2 R21.1 U3.5(VCCA)
SD_CD: R20.1 R21.2
SD_CLK: U3.9(CLKA)
SD_CMD: U3.4(CMDA)
SD_D0: U3.6(DAT0A)
SD_D1: U3.7(DAT1A)
SD_D2: U3.1(DAT2A)
SD_D3: U3.3(DAT3A)
NetCARD1_1: CARD1.1(DAT2(RSV)) U3.23(DAT2B0)
NetCARD1_2: CARD1.2(CDDAT3(CS)) CARD1.3(CMD(DI)) R22.2 U3.20(CMDB0) U3.22(DAT3B0)
NetCARD1_5: CARD1.5(CLK(SCLK)) U3.19(CLKB0)
NetCARD1_7: CARD1.7(DAT0(D0)) U3.18(DAT0B0)
NetCARD1_8: CARD1.8(DAT1(RSV)) U3.16(DAT1B0)
NetCARD1_9: CARD1.9(CD) R20.2
NetR19_2: R19.2 U3.24(SEL)

Not connected (* = marked no-connect by the designer): U3 8(DAT2B1) 10(DAT3B1) 12(CMDB1) 13(CLKB1) 14(DAT0B1) 15(DAT1B1)

### Library data of the parts
C92-C94 = Cap Semi: Capacitor (Semiconductor SIM Model); Published: 8-Jun-2000; LatestRevisionDate: 29-May-2009; LatestRevisionNote: IPC-7351 Footprint Added.; PackageReference: C1206; Publisher: Altium Limited; PackageDescription: Chip Capacitor
CARD1 = TF-01A: BOM_Manufacturer: HRO; BOM_Supplier: LCSC; BOM_Manufacturer Part: TF-01A; BOM_Supplier Part: C91145; spicePre: C; spiceSymbolName: TF-01A
R19-R22 = Res3: Resistor; Published: 8-Jun-2000; LatestRevisionDate: 29-May-2009; LatestRevisionNote: IPC-7351 Footprint Added.; PackageReference: J1-0603; Publisher: Altium Limited; PackageDescription: Chip Resistor
U3 = TXS02612RTWR: BOM_Manufacturer: Texas Instruments; Contributor: LCSC; BOM_Supplier: LCSC; BOM_Supplier Part: C140276; BOM_Manufacturer Part: TXS02612RTWR; spicePre: U; spiceSymbolName: TXS02612RTWR

## Sheet BANK115-116-117-118.SchDoc
size A4
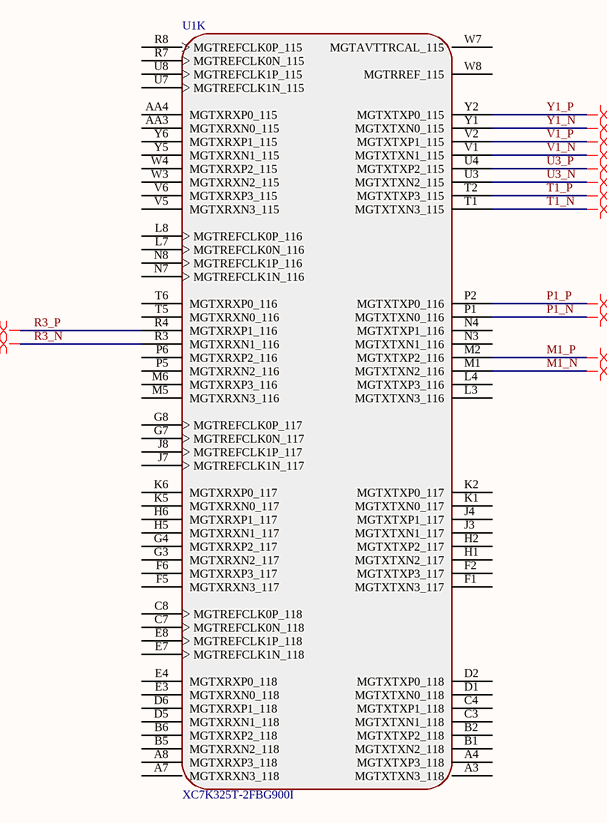
[diagram p9: BANK115-116-117-118.SchDoc]

### Parts
U1  XC7K325T-2FBG900I  (part K of 17)

### Nets
M1_N: U1.M1(MGTXTXN2_116)
M1_P: U1.M2(MGTXTXP2_116)
P1_N: U1.P1(MGTXTXN0_116)
P1_P: U1.P2(MGTXTXP0_116)
R3_N: U1.R3(MGTXRXN1_116)
R3_P: U1.R4(MGTXRXP1_116)
T1_N: U1.T1(MGTXTXN3_115)
T1_P: U1.T2(MGTXTXP3_115)
U3_N: U1.U3(MGTXTXN2_115)
U3_P: U1.U4(MGTXTXP2_115)
V1_N: U1.V1(MGTXTXN1_115)
V1_P: U1.V2(MGTXTXP1_115)
Y1_N: U1.Y1(MGTXTXN0_115)
Y1_P: U1.Y2(MGTXTXP0_115)

Not connected (* = marked no-connect by the designer): U1 A3(MGTXTXN3_118) A4(MGTXTXP3_118) A7(MGTXRXN3_118) A8(MGTXRXP3_118) AA3(MGTXRXN0_115) AA4(MGTXRXP0_115) B1(MGTXTXN2_118) B2(MGTXTXP2_118) B5(MGTXRXN2_118) B6(MGTXRXP2_118) C3(MGTXTXN1_118) C4(MGTXTXP1_118) C7(MGTREFCLK0N_118) C8(MGTREFCLK0P_118) D1(MGTXTXN0_118) D2(MGTXTXP0_118) D5(MGTXRXN1_118) D6(MGTXRXP1_118) E3(MGTXRXN0_118) E4(MGTXRXP0_118) E7(MGTREFCLK1N_118) E8(MGTREFCLK1P_118) F1(MGTXTXN3_117) F2(MGTXTXP3_117) F5(MGTXRXN3_117) F6(MGTXRXP3_117) G3(MGTXRXN2_117) G4(MGTXRXP2_117) G7(MGTREFCLK0N_117) G8(MGTREFCLK0P_117) H1(MGTXTXN2_117) H2(MGTXTXP2_117) H5(MGTXRXN1_117) H6(MGTXRXP1_117) J3(MGTXTXN1_117) J4(MGTXTXP1_117) J7(MGTREFCLK1N_117) J8(MGTREFCLK1P_117) K1(MGTXTXN0_117) K2(MGTXTXP0_117) K5(MGTXRXN0_117) K6(MGTXRXP0_117) L3(MGTXTXN3_116) L4(MGTXTXP3_116) L7(MGTREFCLK0N_116) L8(MGTREFCLK0P_116) M5(MGTXRXN3_116) M6(MGTXRXP3_116) N3(MGTXTXN1_116) N4(MGTXTXP1_116) N7(MGTREFCLK1N_116) N8(MGTREFCLK1P_116) P5(MGTXRXN2_116) P6(MGTXRXP2_116) R7(MGTREFCLK0N_115) R8(MGTREFCLK0P_115) T5(MGTXRXN0_116) T6(MGTXRXP0_116) U7(MGTREFCLK1N_115) U8(MGTREFCLK1P_115) V5(MGTXRXN3_115) V6(MGTXRXP3_115) W3(MGTXRXN2_115) W4(MGTXRXP2_115) W7(MGTAVTTRCAL_115) W8(MGTRREF_115) Y5(MGTXRXN1_115) Y6(MGTXRXP1_115)

### Layout directives
differential pair: M1_N, M1_P, P1_N, P1_P, R3_N, R3_P, T1_N, T1_P, U3_N, U3_P, V1_N, V1_P, Y1_N, Y1_P

## Sheet FPGA Power.SchDoc
size A4
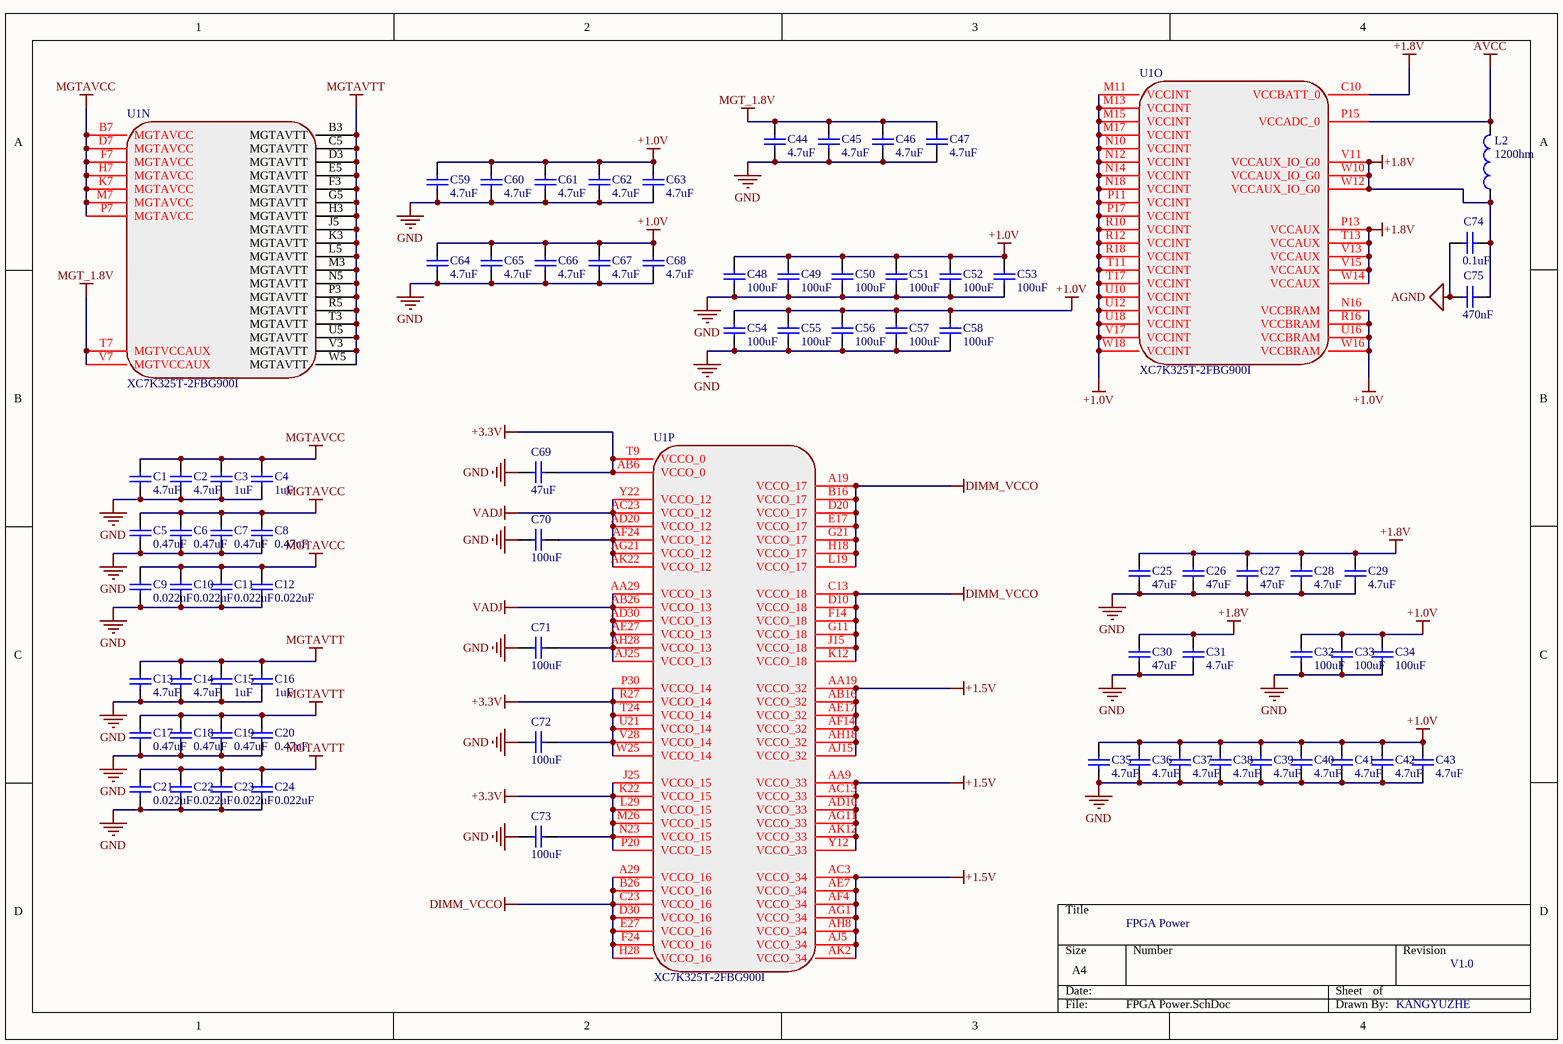
[diagram p10: FPGA Power.SchDoc]

### Parts
C1  value 4.7uF  [0402]  (hidden comment: Cap Semi)
C2  value 4.7uF  [0402]  (hidden comment: Cap Semi)
C3  value 1uF  [0402]  (hidden comment: Cap Semi)
C4  value 1uF  [0402]  (hidden comment: Cap Semi)
C5  value 0.47uF  [0402]  (hidden comment: Cap Semi)
C6  value 0.47uF  [0402]  (hidden comment: Cap Semi)
C7  value 0.47uF  [0402]  (hidden comment: Cap Semi)
C8  value 0.47uF  [0402]  (hidden comment: Cap Semi)
C9  value 0.022uF  [0402]  (hidden comment: Cap Semi)
C10  value 0.022uF  [0402]  (hidden comment: Cap Semi)
C11  value 0.022uF  [0402]  (hidden comment: Cap Semi)
C12  value 0.022uF  [0402]  (hidden comment: Cap Semi)
C13  value 4.7uF  [0402]  (hidden comment: Cap Semi)
C14  value 4.7uF  [0402]  (hidden comment: Cap Semi)
C15  value 1uF  [0402]  (hidden comment: Cap Semi)
C16  value 1uF  [0402]  (hidden comment: Cap Semi)
C17  value 0.47uF  [0402]  (hidden comment: Cap Semi)
C18  value 0.47uF  [0402]  (hidden comment: Cap Semi)
C19  value 0.47uF  [0402]  (hidden comment: Cap Semi)
C20  value 0.47uF  [0402]  (hidden comment: Cap Semi)
C21  value 0.022uF  [0402]  (hidden comment: Cap Semi)
C22  value 0.022uF  [0402]  (hidden comment: Cap Semi)
C23  value 0.022uF  [0402]  (hidden comment: Cap Semi)
C24  value 0.022uF  [0402]  (hidden comment: Cap Semi)
C25  value 47uF  [0402]  (hidden comment: Cap Semi)
C26  value 47uF  [0402]  (hidden comment: Cap Semi)
C27  value 47uF  [0402]  (hidden comment: Cap Semi)
C28  value 4.7uF  [0402]  (hidden comment: Cap Semi)
C29  value 4.7uF  [0402]  (hidden comment: Cap Semi)
C30  value 47uF  [0402]  (hidden comment: Cap Semi)
C31  value 4.7uF  [0402]  (hidden comment: Cap Semi)
C32  value 100uF  [0402]  (hidden comment: Cap Semi)
C33  value 100uF  [0402]  (hidden comment: Cap Semi)
C34  value 100uF  [0402]  (hidden comment: Cap Semi)
C35  value 4.7uF  [0402]  (hidden comment: Cap Semi)
C36  value 4.7uF  [0402]  (hidden comment: Cap Semi)
C37  value 4.7uF  [0402]  (hidden comment: Cap Semi)
C38  value 4.7uF  [0402]  (hidden comment: Cap Semi)
C39  value 4.7uF  [0402]  (hidden comment: Cap Semi)
C40  value 4.7uF  [0402]  (hidden comment: Cap Semi)
C41  value 4.7uF  [0402]  (hidden comment: Cap Semi)
C42  value 4.7uF  [0402]  (hidden comment: Cap Semi)
C43  value 4.7uF  [0402]  (hidden comment: Cap Semi)
C44  value 4.7uF  [0402]  (hidden comment: Cap Semi)
C45  value 4.7uF  [0402]  (hidden comment: Cap Semi)
C46  value 4.7uF  [0402]  (hidden comment: Cap Semi)
C47  value 4.7uF  [0402]  (hidden comment: Cap Semi)
C48  value 100uF  [0402]  (hidden comment: Cap Semi)
C49  value 100uF  [0402]  (hidden comment: Cap Semi)
C50  value 100uF  [0402]  (hidden comment: Cap Semi)
C51  value 100uF  [0402]  (hidden comment: Cap Semi)
C52  value 100uF  [0402]  (hidden comment: Cap Semi)
C53  value 100uF  [0402]  (hidden comment: Cap Semi)
C54  value 100uF  [0402]  (hidden comment: Cap Semi)
C55  value 100uF  [0402]  (hidden comment: Cap Semi)
C56  value 100uF  [0402]  (hidden comment: Cap Semi)
C57  value 100uF  [0402]  (hidden comment: Cap Semi)
C58  value 100uF  [0402]  (hidden comment: Cap Semi)
C59  value 4.7uF  [0402]  (hidden comment: Cap Semi)
C60  value 4.7uF  [0402]  (hidden comment: Cap Semi)
C61  value 4.7uF  [0402]  (hidden comment: Cap Semi)
C62  value 4.7uF  [0402]  (hidden comment: Cap Semi)
C63  value 4.7uF  [0402]  (hidden comment: Cap Semi)
C64  value 4.7uF  [0402]  (hidden comment: Cap Semi)
C65  value 4.7uF  [0402]  (hidden comment: Cap Semi)
C66  value 4.7uF  [0402]  (hidden comment: Cap Semi)
C67  value 4.7uF  [0402]  (hidden comment: Cap Semi)
C68  value 4.7uF  [0402]  (hidden comment: Cap Semi)
C69  value 47uF  [0402]  (hidden comment: Cap Semi)
C70  value 100uF  [0402]  (hidden comment: Cap Semi)
C71  value 100uF  [0402]  (hidden comment: Cap Semi)
C72  value 100uF  [0402]  (hidden comment: Cap Semi)
C73  value 100uF  [0402]  (hidden comment: Cap Semi)
C74  value 0.1uF  [0402]  (hidden comment: Cap Semi)
C75  value 470nF  [0402]  (hidden comment: Cap Semi)
L2  value 1200hm  [0402-A]  (hidden comment: Inductor)
U1  XC7K325T-2FBG900I  (parts N,O,P of 17)

### Nets
+1.0V: C32.2 C33.2 C34.2 C35.2 C36.2 C37.2 C38.2 C39.2 C40.2 C41.2 C42.2 C43.2 C48.2 C49.2 C50.2 C51.2 C52.2 C53.2 C54.2 C55.2 C56.2 C57.2 C58.2 C59.2 C60.2 C61.2 C62.2 C63.2 C64.2 C65.2 C66.2 C67.2 C68.2 U1.M11(VCCINT) U1.M13(VCCINT) U1.M15(VCCINT) U1.M17(VCCINT) U1.N10(VCCINT) U1.N12(VCCINT) U1.N14(VCCINT) U1.N16(VCCBRAM) U1.N18(VCCINT) U1.P11(VCCINT) U1.P17(VCCINT) U1.R10(VCCINT) U1.R12(VCCINT) U1.R16(VCCBRAM) U1.R18(VCCINT) U1.T11(VCCINT) U1.T17(VCCINT) U1.U10(VCCINT) U1.U12(VCCINT) U1.U16(VCCBRAM) U1.U18(VCCINT) U1.V17(VCCINT) U1.W16(VCCBRAM) U1.W18(VCCINT)
+1.5V: U1.AA9(VCCO_33) U1.AA19(VCCO_32) U1.AB16(VCCO_32) U1.AC3(VCCO_34) U1.AC13(VCCO_33) U1.AD10(VCCO_33) U1.AE7(VCCO_34) U1.AE17(VCCO_32) U1.AF4(VCCO_34) U1.AF14(VCCO_32) U1.AG1(VCCO_34) U1.AG11(VCCO_33) U1.AH8(VCCO_34) U1.AH18(VCCO_32) U1.AJ5(VCCO_34) U1.AJ15(VCCO_32) U1.AK2(VCCO_34) U1.AK12(VCCO_33) U1.Y12(VCCO_33)
+1.8V: C25.2 C26.2 C27.2 C28.2 C29.2 C30.2 C31.2 C74.2 C75.2 L2.1 U1.C10(VCCBATT_0) U1.P13(VCCAUX) U1.T13(VCCAUX) U1.V11(VCCAUX_IO_G0) U1.V13(VCCAUX) U1.V15(VCCAUX) U1.W10(VCCAUX_IO_G0) U1.W12(VCCAUX_IO_G0) U1.W14(VCCAUX)
+3.3V: C69.2 C72.2 C73.2 U1.AB6(VCCO_0) U1.J25(VCCO_15) U1.K22(VCCO_15) U1.L29(VCCO_15) U1.M26(VCCO_15) U1.N23(VCCO_15) U1.P20(VCCO_15) U1.P30(VCCO_14) U1.R27(VCCO_14) U1.T9(VCCO_0) U1.T24(VCCO_14) U1.U21(VCCO_14) U1.V28(VCCO_14) U1.W25(VCCO_14)
AGND: C74.1 C75.1
AVCC: L2.2 U1.P15(VCCADC_0)
DIMM_VCCO: U1.A19(VCCO_17) U1.A29(VCCO_16) U1.B16(VCCO_17) U1.B26(VCCO_16) U1.C13(VCCO_18) U1.C23(VCCO_16) U1.D10(VCCO_18) U1.D20(VCCO_17) U1.D30(VCCO_16) U1.E17(VCCO_17) U1.E27(VCCO_16) U1.F14(VCCO_18) U1.F24(VCCO_16) U1.G11(VCCO_18) U1.G21(VCCO_17) U1.H18(VCCO_17) U1.H28(VCCO_16) U1.J15(VCCO_18) U1.K12(VCCO_18) U1.L19(VCCO_17)
GND: C1.2 C2.1 C3.1 C4.1 C5.1 C6.1 C7.1 C8.1 C9.1 C10.1 C11.1 C12.1 C13.2 C14.1 C15.1 C16.1 C17.1 C18.1 C19.1 C20.1 C21.1 C22.1 C23.1 C24.1 C25.1 C26.1 C27.1 C28.1 C29.1 C30.1 C31.1 C32.1 C33.1 C34.1 C35.1 C36.1 C37.1 C38.1 C39.1 C40.1 C41.1 C42.1 C43.1 C44.1 C45.1 C46.1 C47.1 C48.1 C49.1 C50.1 C51.1 C52.1 C53.1 C54.1 C55.1 C56.1 C57.1 C58.1 C59.1 C60.1 C61.1 C62.1 C63.1 C64.1 C65.1 C66.1 C67.1 C68.1 C69.1 C70.1 C71.1 C72.1 C73.1
MGT_1.8V: C44.2 C45.2 C46.2 C47.2 U1.T7(MGTVCCAUX) U1.V7(MGTVCCAUX)
MGTAVCC: C1.1 C2.2 C3.2 C4.2 C5.2 C6.2 C7.2 C8.2 C9.2 C10.2 C11.2 C12.2 U1.B7(MGTAVCC) U1.D7(MGTAVCC) U1.F7(MGTAVCC) U1.H7(MGTAVCC) U1.K7(MGTAVCC) U1.M7(MGTAVCC) U1.P7(MGTAVCC)
MGTAVTT: C13.1 C14.2 C15.2 C16.2 C17.2 C18.2 C19.2 C20.2 C21.2 C22.2 C23.2 C24.2 U1.B3(MGTAVTT) U1.C5(MGTAVTT) U1.D3(MGTAVTT) U1.E5(MGTAVTT) U1.F3(MGTAVTT) U1.G5(MGTAVTT) U1.H3(MGTAVTT) U1.J5(MGTAVTT) U1.K3(MGTAVTT) U1.L5(MGTAVTT) U1.M3(MGTAVTT) U1.N5(MGTAVTT) U1.P3(MGTAVTT) U1.R5(MGTAVTT) U1.T3(MGTAVTT) U1.U5(MGTAVTT) U1.V3(MGTAVTT) U1.W5(MGTAVTT)
VADJ: C70.2 C71.2 U1.AA29(VCCO_13) U1.AB26(VCCO_13) U1.AC23(VCCO_12) U1.AD20(VCCO_12) U1.AD30(VCCO_13) U1.AE27(VCCO_13) U1.AF24(VCCO_12) U1.AG21(VCCO_12) U1.AH28(VCCO_13) U1.AJ25(VCCO_13) U1.AK22(VCCO_12) U1.Y22(VCCO_12)

### Notes on the sheet
- FPGA Power
- V1.0
- KANGYUZHE

### Library data of the parts
C1-C75 = Cap Semi: Capacitor (Semiconductor SIM Model); Published: 8-Jun-2000; LatestRevisionDate: 29-May-2009; LatestRevisionNote: IPC-7351 Footprint Added.; PackageReference: C1206; Publisher: Altium Limited; PackageDescription: Chip Capacitor
L2 = Inductor: Code_IEC: 1005; Published: 8-Jun-2000; LatestRevisionDate: 29-May-2009; LatestRevisionNote: IPC-7351 Footprint Added.; PackageReference: 0402-A; Publisher: Altium Limited; PackageDescription: Chip Inductor; Code_JEITA: 0402

## Sheet PAGE15 FLASH.SchDoc
size A4
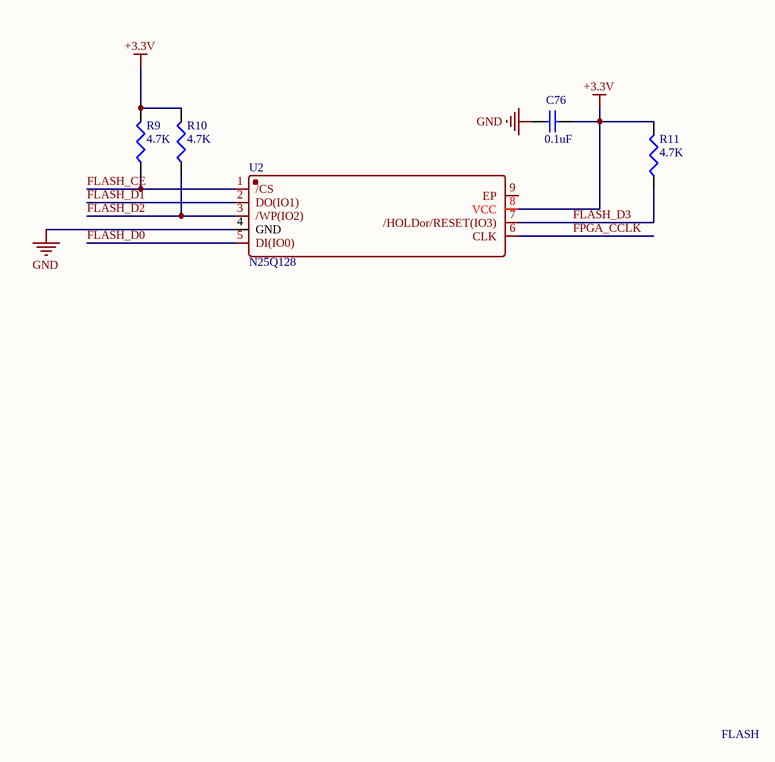
[diagram p11: PAGE15 FLASH.SchDoc]

### Parts
C76  value 0.1uF  [0402]  (hidden comment: Cap Semi)
R9  value 4.7K  [J1-0603]  (hidden comment: Res3)
R10  value 4.7K  [J1-0603]  (hidden comment: Res3)
R11  value 4.7K  [J1-0603]  (hidden comment: Res3)
U2  N25Q128  [WSON-8_L6.0-W8.0-P1.27-BL-EP]

### Nets
+3.3V: C76.2 R9.2 R10.2 R11.2 U2.8(VCC)
GND: C76.1 U2.4(GND)
FLASH_CE: R9.1 U2.1(/CS)
FLASH_D0: U2.5(DI(IO0))
FLASH_D1: U2.2(DO(IO1))
FLASH_D2: R10.1 U2.3(/WP(IO2))
FLASH_D3: R11.1 U2.7(/HOLDor/RESET(IO3))
FPGA_CCLK: U2.6(CLK)

Not connected (* = marked no-connect by the designer): U2 9(EP)

### Notes on the sheet
- FLASH

### Library data of the parts
C76 = Cap Semi: Capacitor (Semiconductor SIM Model); Published: 8-Jun-2000; LatestRevisionDate: 29-May-2009; LatestRevisionNote: IPC-7351 Footprint Added.; PackageReference: C1206; Publisher: Altium Limited; PackageDescription: Chip Capacitor
R9-R11 = Res3: Resistor; Published: 8-Jun-2000; LatestRevisionDate: 29-May-2009; LatestRevisionNote: IPC-7351 Footprint Added.; PackageReference: J1-0603; Publisher: Altium Limited; PackageDescription: Chip Resistor

## Sheet CLOCK.SchDoc
size A4
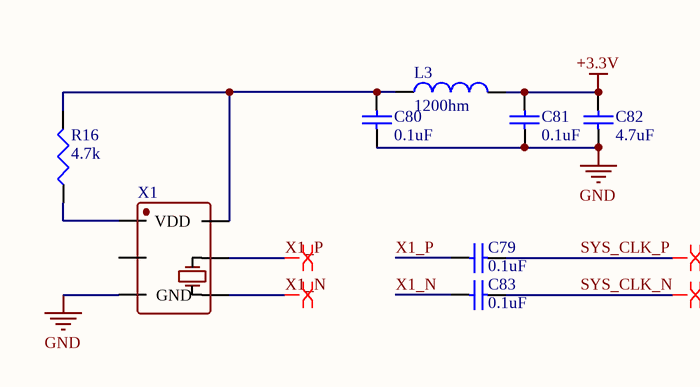
[diagram p12: CLOCK.SchDoc]

### Parts
C79  value 0.1uF  [0402]  (hidden comment: Cap Semi)
C80  value 0.1uF  [0402]  (hidden comment: Cap Semi)
C81  value 0.1uF  [0402]  (hidden comment: Cap Semi)
C82  value 4.7uF  [0402]  (hidden comment: Cap Semi)
C83  value 0.1uF  [0402]  (hidden comment: Cap Semi)
L3  value 1200hm  [0402-A]  (hidden comment: Inductor)
R16  value 4.7k  [J1-0603]  (hidden comment: Res3)
X1  晶振  [OSC6-5X7]  (value not drawn)

### Nets
+3.3V: C81.2 C82.2 L3.2
GND: C80.1 C81.1 C82.1 X1.3(GND)
SYS_CLK_N: C83.2
SYS_CLK_P: C79.2
X1_N: C83.1 X1.4
X1_P: C79.1 X1.5
NetC80_2: C80.2 L3.1 R16.2 X1.6(VDD)
NetR16_1: R16.1 X1.1(E/D)

Not connected (* = marked no-connect by the designer): X1 2(E/D)

### Layout directives
differential pair: SYS_CLK_N, SYS_CLK_P, X1_N, X1_P

### Library data of the parts
C79-C83 = Cap Semi: Capacitor (Semiconductor SIM Model); Published: 8-Jun-2000; LatestRevisionDate: 29-May-2009; LatestRevisionNote: IPC-7351 Footprint Added.; PackageReference: C1206; Publisher: Altium Limited; PackageDescription: Chip Capacitor
L3 = Inductor: Code_IEC: 1005; Published: 8-Jun-2000; LatestRevisionDate: 29-May-2009; LatestRevisionNote: IPC-7351 Footprint Added.; PackageReference: 0402-A; Publisher: Altium Limited; PackageDescription: Chip Inductor; Code_JEITA: 0402
R16 = Res3: Resistor; Published: 8-Jun-2000; LatestRevisionDate: 29-May-2009; LatestRevisionNote: IPC-7351 Footprint Added.; PackageReference: J1-0603; Publisher: Altium Limited; PackageDescription: Chip Resistor

## Sheet INPUT.SchDoc
size A4
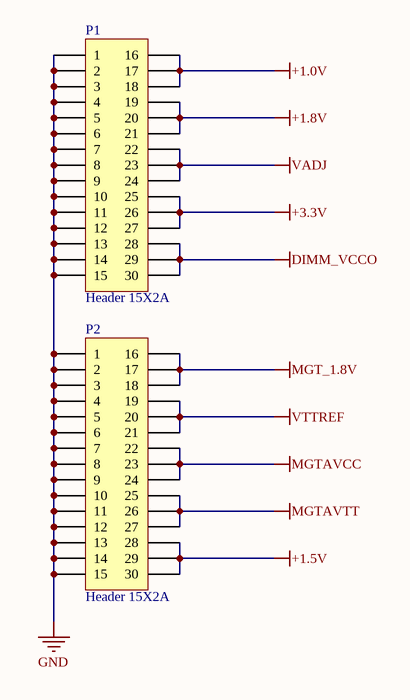
[diagram p13: INPUT.SchDoc]

### Parts
P1  Header 15X2A  [HDR2X15_CEN]
P2  Header 15X2A  [HDR2X15_CEN]

### Nets
+1.0V: P1.16 P1.17 P1.18
+1.5V: P2.28 P2.29 P2.30
+1.8V: P1.19 P1.20 P1.21
+3.3V: P1.25 P1.26 P1.27
DIMM_VCCO: P1.28 P1.29 P1.30
GND: P1.1 P1.2 P1.3 P1.4 P1.5 P1.6 P1.7 P1.8 P1.9 P1.10 P1.11 P1.12 P1.13 P1.14 P1.15 P2.1 P2.2 P2.3 P2.4 P2.5 P2.6 P2.7 P2.8 P2.9 P2.10 P2.11 P2.12 P2.13 P2.14 P2.15
MGT_1.8V: P2.16 P2.17 P2.18
MGTAVCC: P2.22 P2.23 P2.24
MGTAVTT: P2.25 P2.26 P2.27
VADJ: P1.22 P1.23 P1.24
VTTREF: P2.19 P2.20 P2.21

### Library data of the parts
P1 P2 = Header 15X2A: Header, 15-Pin, Dual row; LatestRevisionDate: 17-Jul-2002; LatestRevisionNote: Re-released for DXP Platform.; Publisher: Altium Limited

## Sheet IO.SchDoc
size A4
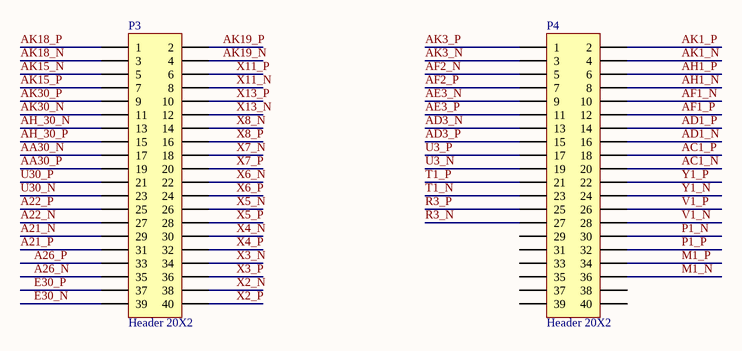
[diagram p14: IO.SchDoc]

### Parts
P3  Header 20X2  [HDR2X20]
P4  Header 20X2  [HDR2X20]

### Nets
A21_N: P3.29
A21_P: P3.31
A22_N: P3.27
A22_P: P3.25
A26_N: P3.35
A26_P: P3.33
AA30_N: P3.17
AA30_P: P3.19
AC1_N: P4.20
AC1_P: P4.18
AD1_N: P4.16
AD1_P: P4.14
AD3_N: P4.13
AD3_P: P4.15
AE3_N: P4.9
AE3_P: P4.11
AF1_N: P4.10
AF1_P: P4.12
AF2_N: P4.5
AF2_P: P4.7
AH1_N: P4.8
AH1_P: P4.6
AH_30_N: P3.13
AH_30_P: P3.15
AK1_N: P4.4
AK1_P: P4.2
AK3_N: P4.3
AK3_P: P4.1
AK15_N: P3.5
AK15_P: P3.7
AK18_N: P3.3
AK18_P: P3.1
AK19_N: P3.4
AK19_P: P3.2
AK30_N: P3.11
AK30_P: P3.9
E30_N: P3.39
E30_P: P3.37
M1_N: P4.36
M1_P: P4.34
P1_N: P4.30
P1_P: P4.32
R3_N: P4.27
R3_P: P4.25
T1_N: P4.23
T1_P: P4.21
U3_N: P4.19
U3_P: P4.17
U30_N: P3.23
U30_P: P3.21
V1_N: P4.28
V1_P: P4.26
X2_N: P3.38
X2_P: P3.40
X3_N: P3.34
X3_P: P3.36
X4_N: P3.30
X4_P: P3.32
X5_N: P3.26
X5_P: P3.28
X6_N: P3.22
X6_P: P3.24
X7_N: P3.18
X7_P: P3.20
X8_N: P3.14
X8_P: P3.16
X11_N: P3.8
X11_P: P3.6
X13_N: P3.12
X13_P: P3.10
Y1_N: P4.24
Y1_P: P4.22

Not connected (* = marked no-connect by the designer): P4 29 31 33 35 37 38 39 40

### Library data of the parts
P3 P4 = Header 20X2: Header, 20-Pin, Dual row; LatestRevisionDate: 17-Jul-2002; LatestRevisionNote: Re-released for DXP Platform.; Publisher: Altium Limited

## Nets that join several sheets
+1.0V: FPGA Power (57 pins), INPUT (P1.16 P1.17 P1.18)
+1.5V: BANK32-33 (7 pins), BANK34 (C97.2 C98.2 C99.2), FPGA Power (19 pins), INPUT (P2.28 P2.29 P2.30)
+1.8V: FPGA Power (19 pins), INPUT (P1.19 P1.20 P1.21)
+3.3V: BANK0 (12 pins), SD&UART&Sensor (6 pins), FPGA Power (17 pins), PAGE15 FLASH (5 pins), CLOCK (C81.2 C82.2 L3.2), INPUT (P1.25 P1.26 P1.27)
AGND: GND (U1.P14), BANK0 (L1.2 U1.R14 U1.T15), FPGA Power (C74.1 C75.1)
DIMM_VCCO: FPGA Power (20 pins), INPUT (P1.28 P1.29 P1.30)
GND: GND (173 pins), BANK0 (13 pins), BANK14-15 (R15.1), BANK32-33 (9 pins), BANK34 (5 pins), SD&UART&Sensor (12 pins), FPGA Power (73 pins), PAGE15 FLASH (C76.1 U2.4), CLOCK (C80.1 C81.1 C82.1 X1.3), INPUT (30 pins)
MGT_1.8V: FPGA Power (6 pins), INPUT (P2.16 P2.17 P2.18)
MGTAVCC: FPGA Power (19 pins), INPUT (P2.22 P2.23 P2.24)
MGTAVTT: FPGA Power (30 pins), INPUT (P2.25 P2.26 P2.27)
VADJ: SD&UART&Sensor (C92.2 R21.1 U3.5), FPGA Power (14 pins), INPUT (P1.22 P1.23 P1.24)
VTTREF: BANK32-33 (C87.2 C88.2 U1.AE14 U1.AF16), BANK34 (C95.1 C96.1 U1.AD7 U1.AG8), INPUT (P2.19 P2.20 P2.21)
A21_N: BANK16-17 (U1.A21), IO (P3.29)
A21_P: BANK16-17 (U1.A20), IO (P3.31)
A22_N: BANK16-17 (U1.A22), IO (P3.27)
A22_P: BANK16-17 (U1.B22), IO (P3.25)
A26_N: BANK16-17 (U1.A26), IO (P3.35)
A26_P: BANK16-17 (U1.A25), IO (P3.33)
AA30_N: BANK12-13 (U1.AA30), IO (P3.17)
AA30_P: BANK12-13 (U1.Y30), IO (P3.19)
AC1_N: BANK34 (U1.AC1), IO (P4.20)
AC1_P: BANK34 (U1.AC2), IO (P4.18)
AD1_N: BANK34 (U1.AD1), IO (P4.16)
AD1_P: BANK34 (U1.AD2), IO (P4.14)
AD3_N: BANK34 (U1.AD3), IO (P4.13)
AD3_P: BANK34 (U1.AD4), IO (P4.15)
AE3_N: BANK34 (U1.AE3), IO (P4.9)
AE3_P: BANK34 (U1.AE4), IO (P4.11)
AF1_N: BANK34 (U1.AF1), IO (P4.10)
AF1_P: BANK34 (U1.AE1), IO (P4.12)
AF2_N: BANK34 (U1.AF2), IO (P4.5)
AF2_P: BANK34 (U1.AF3), IO (P4.7)
AH1_N: BANK34 (U1.AH1), IO (P4.8)
AH1_P: BANK34 (U1.AG2), IO (P4.6)
AH_30_N: BANK12-13 (U1.AH30), IO (P3.13)
AH_30_P: BANK12-13 (U1.AG30), IO (P3.15)
AK1_N: BANK34 (U1.AJ1), IO (P4.4)
AK1_P: BANK34 (U1.AK1), IO (P4.2)
AK3_N: BANK34 (U1.AK3), IO (P4.3)
AK3_P: BANK34 (U1.AJ3), IO (P4.1)
AK15_N: BANK32-33 (U1.AK15), IO (P3.5)
AK15_P: BANK32-33 (U1.AK16), IO (P3.7)
AK18_N: BANK32-33 (U1.AK18), IO (P3.3)
AK18_P: BANK32-33 (U1.AJ18), IO (P3.1)
AK19_N: BANK32-33 (U1.AK19), IO (P3.4)
AK19_P: BANK32-33 (U1.AJ19), IO (P3.2)
AK30_N: BANK12-13 (U1.AK30), IO (P3.11)
AK30_P: BANK12-13 (U1.AK29), IO (P3.9)
E30_N: BANK16-17 (U1.E30), IO (P3.39)
E30_P: BANK16-17 (U1.E29), IO (P3.37)
FLASH_CE: BANK14-15 (U1.U19), PAGE15 FLASH (R9.1 U2.1)
FLASH_D0: BANK14-15 (U1.P24), PAGE15 FLASH (U2.5)
FLASH_D1: BANK14-15 (U1.R25), PAGE15 FLASH (U2.2)
FLASH_D2: BANK14-15 (U1.R20), PAGE15 FLASH (R10.1 U2.3)
FLASH_D3: BANK14-15 (U1.R21), PAGE15 FLASH (R11.1 U2.7)
FPGA_CCLK: BANK0 (R12.2), PAGE15 FLASH (U2.6)
M1_N: BANK115-116-117-118 (U1.M1), IO (P4.36)
M1_P: BANK115-116-117-118 (U1.M2), IO (P4.34)
P1_N: BANK115-116-117-118 (U1.P1), IO (P4.30)
P1_P: BANK115-116-117-118 (U1.P2), IO (P4.32)
R3_N: BANK115-116-117-118 (U1.R3), IO (P4.27)
R3_P: BANK115-116-117-118 (U1.R4), IO (P4.25)
SD_CD: BANK16-17 (U1.B29), SD&UART&Sensor (R20.1 R21.2)
SD_CLK: BANK16-17 (U1.C29), SD&UART&Sensor (U3.9)
SD_CMD: BANK16-17 (U1.A28), SD&UART&Sensor (U3.4)
SD_D0: BANK16-17 (U1.A30), SD&UART&Sensor (U3.6)
SD_D1: BANK16-17 (U1.B30), SD&UART&Sensor (U3.7)
SD_D2: BANK16-17 (U1.A27), SD&UART&Sensor (U3.1)
SD_D3: BANK16-17 (U1.B28), SD&UART&Sensor (U3.3)
SYS_CLK_N: BANK32-33 (U1.AF10), CLOCK (C83.2)
SYS_CLK_P: BANK32-33 (U1.AE10), CLOCK (C79.2)
T1_N: BANK115-116-117-118 (U1.T1), IO (P4.23)
T1_P: BANK115-116-117-118 (U1.T2), IO (P4.21)
U3_N: BANK115-116-117-118 (U1.U3), IO (P4.19)
U3_P: BANK115-116-117-118 (U1.U4), IO (P4.17)
U30_N: BANK14-15 (U1.U30), IO (P3.23)
U30_P: BANK14-15 (U1.U29), IO (P3.21)
V1_N: BANK115-116-117-118 (U1.V1), IO (P4.28)
V1_P: BANK115-116-117-118 (U1.V2), IO (P4.26)
X2_N: BANK12-13 (U1.Y29), IO (P3.38)
X2_P: BANK12-13 (U1.W29), IO (P3.40)
X3_N: BANK12-13 (U1.AB28), IO (P3.34)
X3_P: BANK12-13 (U1.AA27), IO (P3.36)
X4_N: BANK12-13 (U1.AC30), IO (P3.30)
X4_P: BANK12-13 (U1.AC29), IO (P3.32)
X5_N: BANK12-13 (U1.AF30), IO (P3.26)
X5_P: BANK12-13 (U1.AE30), IO (P3.28)
X6_N: BANK12-13 (U1.AJ29), IO (P3.22)
X6_P: BANK12-13 (U1.AJ28), IO (P3.24)
X7_N: BANK12-13 (U1.AH26), IO (P3.18)
X7_P: BANK12-13 (U1.AH27), IO (P3.20)
X8_N: BANK12-13 (U1.AF27), IO (P3.14)
X8_P: BANK12-13 (U1.AF26), IO (P3.16)
X11_N: BANK12-13 (U1.AK24), IO (P3.8)
X11_P: BANK12-13 (U1.AK23), IO (P3.6)
X13_N: BANK12-13 (U1.AK21), IO (P3.12)
X13_P: BANK12-13 (U1.AK20), IO (P3.10)
Y1_N: BANK115-116-117-118 (U1.Y1), IO (P4.24)
Y1_P: BANK115-116-117-118 (U1.Y2), IO (P4.22)